# Altium project Coral Dev Board Micro.PrjPcb (part 3 of 5)

## Sheet 07 MIMXRT1170 PART3.SchDoc: Coral 6 Layer Template With Controlled Impedances
size A2; ApprovedBy: DNP; CheckedBy: DNP; Author: DNP; CompanyName: Google LLC; DrawnBy: DNP; Engineer: Stefan; Organization: Google LLC; Address1: 1600 Amphitheatre Parkway; Address2: Mountain View, CA 94043; Address3: DNP; Address4: DNP; DocumentNumber: 7; Revision: PVT; SheetNumber: 7; SheetTotal: 17; VersionControl_RevNumber: DNP; IsUserConfigurable: DNP; Time: DNP; ImagePath: DNP; Rule: DNP; ProjectName: Enterprise; Application_BuildNumber: DNP
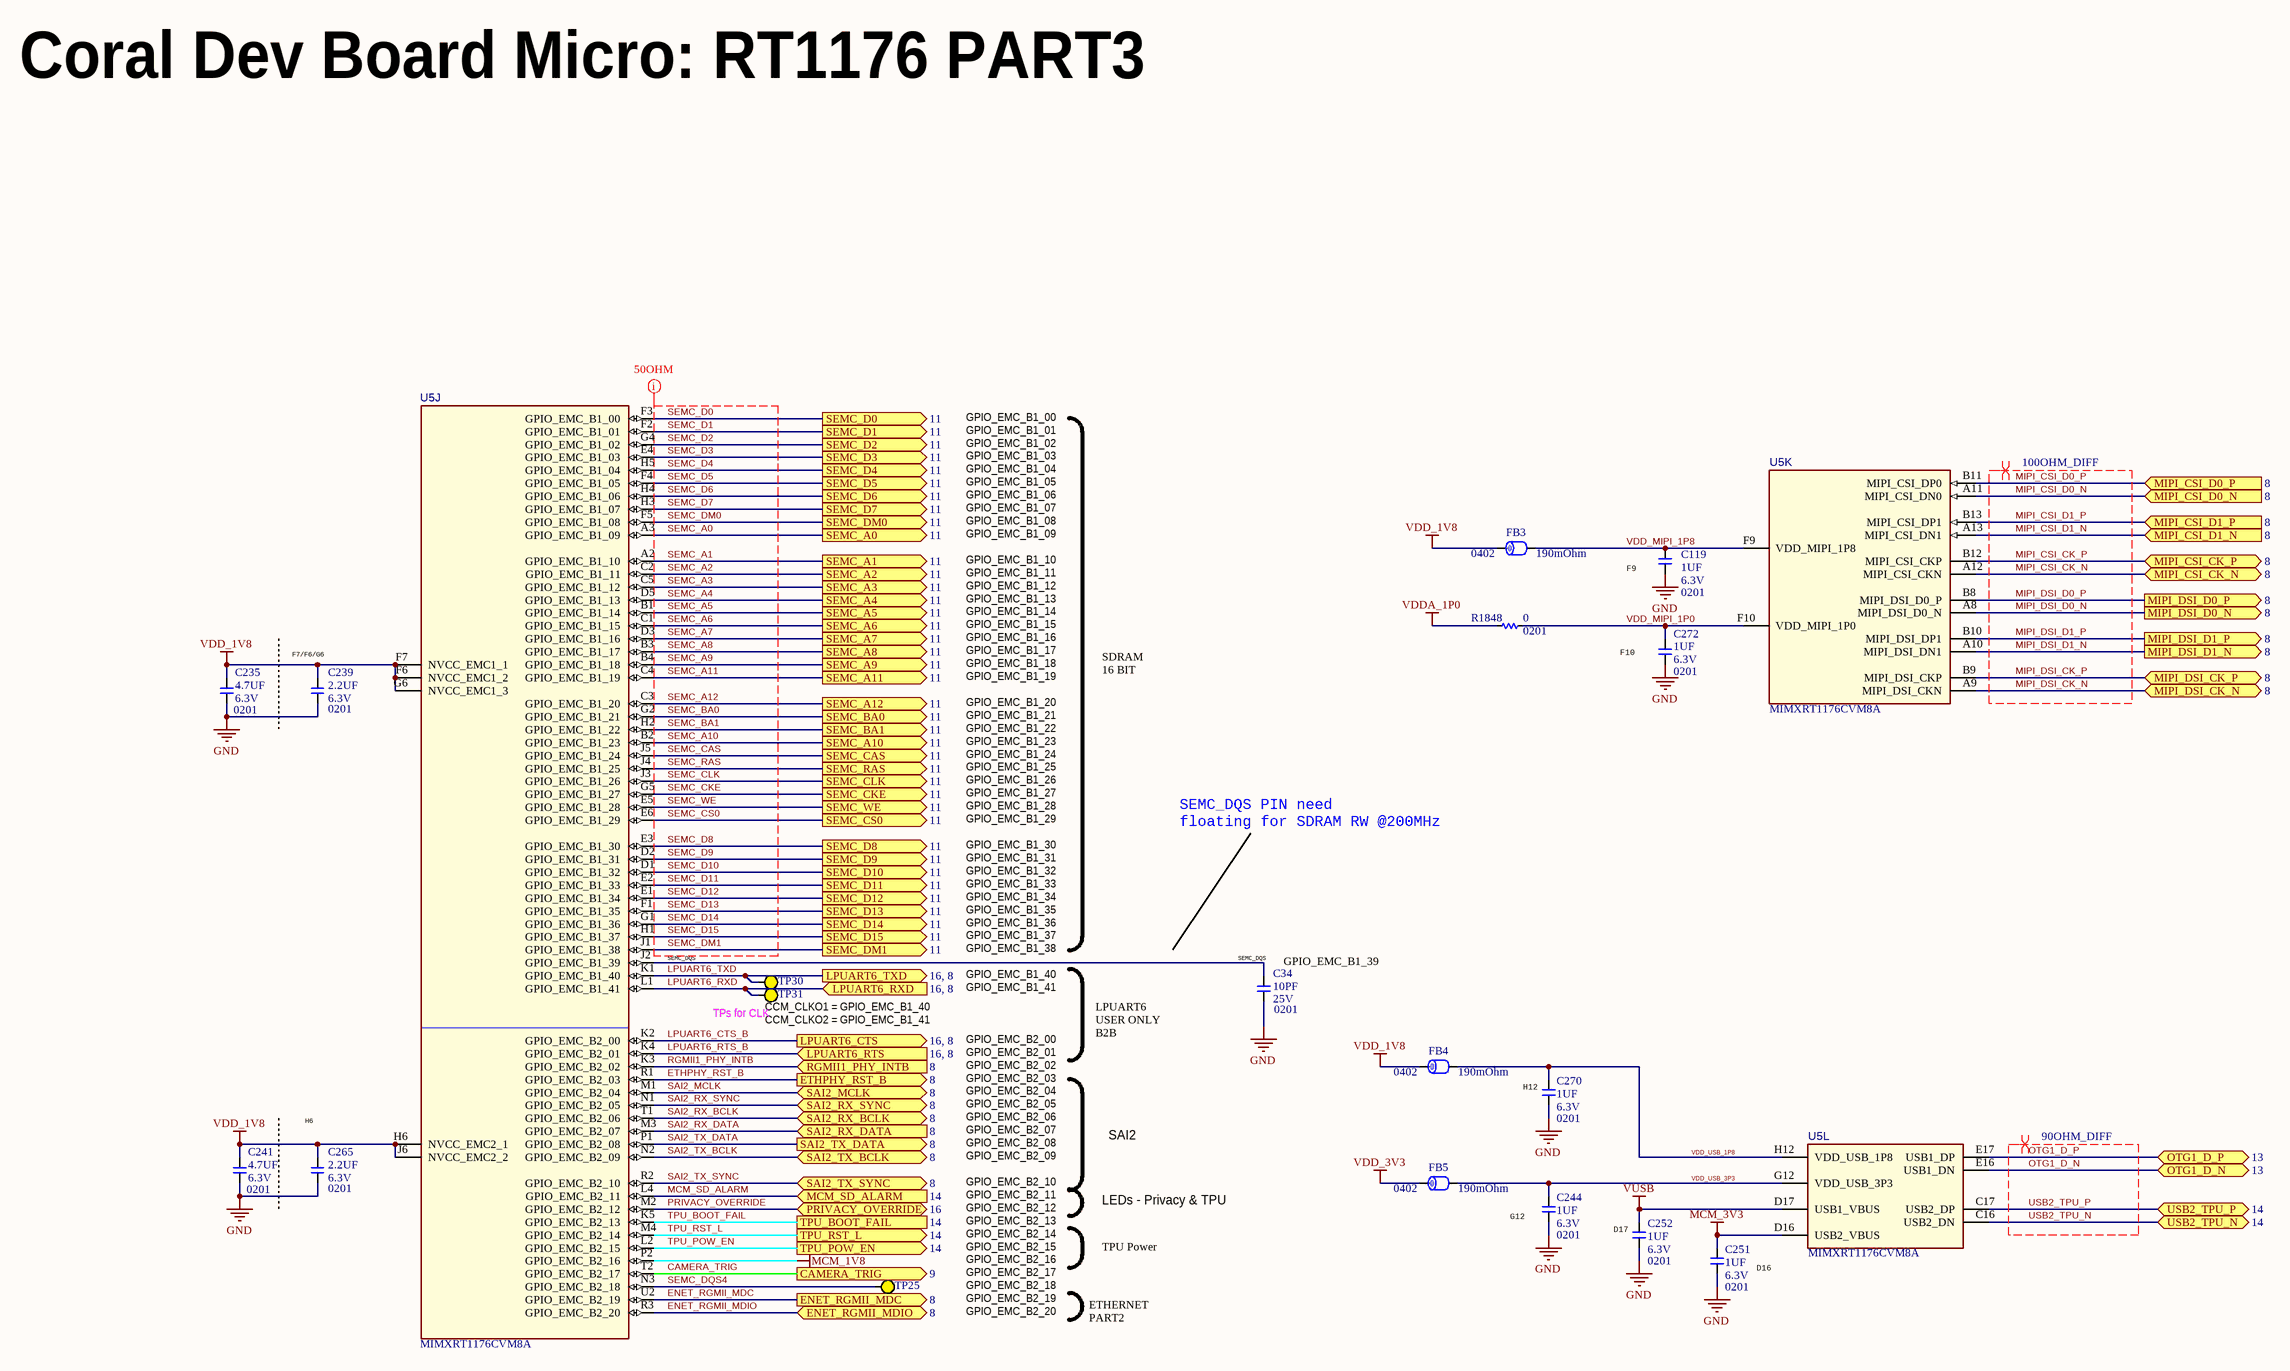
[diagram p10: 07 MIMXRT1170 PART3.SchDoc]

### Parts
C34  value 10PF  Package: 0201  Voltage: 25V  [C0201Y]  (hidden comment: __Template_Cap)
C119  value 1UF  Package: 0201  Voltage: 6.3V  [C0201_H0.39MM]  (hidden comment: __Template_Cap)
C235  value 4.7UF  Package: 0201  Voltage: 6.3V  [C0201Y]  (hidden comment: __Template_Cap)
C239  value 2.2UF  Package: 0201  Voltage: 6.3V  [C0201_H0.39MM]  (hidden comment: __Template_Cap)
C241  value 4.7UF  Package: 0201  Voltage: 6.3V  [C0201Y]  (hidden comment: __Template_Cap)
C244  value 1UF  Package: 0201  Voltage: 6.3V  [C0201_H0.39MM]  (hidden comment: __Template_Cap)
C251  value 1UF  Package: 0201  Voltage: 6.3V  [C0201_H0.39MM]  (hidden comment: __Template_Cap)
C252  value 1UF  Package: 0201  Voltage: 6.3V  [C0201_H0.39MM]  (hidden comment: __Template_Cap)
C265  value 2.2UF  Package: 0201  Voltage: 6.3V  [C0201_H0.39MM]  (hidden comment: __Template_Cap)
C270  value 1UF  Package: 0201  Voltage: 6.3V  [C0201_H0.39MM]  (hidden comment: __Template_Cap)
C272  value 1UF  Package: 0201  Voltage: 6.3V  [C0201_H0.39MM]  (hidden comment: __Template_Cap)
FB3  Package: 0402  Rdc max: 190mOhm  [L0402_H0.55MM]  (hidden comment: __Template_Ferrite_Bead)
FB4  Package: 0402  Rdc max: 190mOhm  [L0402_H0.55MM]  (hidden comment: __Template_Ferrite_Bead)
FB5  Package: 0402  Rdc max: 190mOhm  [L0402_H0.55MM]  (hidden comment: __Template_Ferrite_Bead)
R1848  value 0  Package: 0201  [R0201]
TP25  TESTPAD_30MIL  [TESTPAD_SMT_30MIL]  (value not drawn)  (no BOM)
TP30  TESTPAD_30MIL  [TESTPAD_SMT_30MIL]  (value not drawn)  (no BOM)
TP31  TESTPAD_30MIL  [TESTPAD_SMT_30MIL]  (value not drawn)  (no BOM)
U5  MFG P/N: MIMXRT1176CVM8A  [BGA289C80P17X17_1400X14000X152]  (hidden comment: MCU_MIMXRT1176CVM8A)  (parts J,K,L of 12)

### Ports
CAMERA_TRIG (out, see 9), ENET_RGMII_MDC (out, see 8), ENET_RGMII_MDIO (bidir, see 8), ETHPHY_RST_B (out, see 8), LPUART6_CTS (out, see 16, 8), LPUART6_RTS (in, see 16, 8), LPUART6_RXD (in, see 16, 8), LPUART6_TXD (out, see 16, 8), MCM_SD_ALARM (in, see 14), MIPI_CSI_CK_N (bidir, see 8), MIPI_CSI_CK_P (bidir, see 8), MIPI_CSI_D0_N (in, see 8), MIPI_CSI_D0_P (in, see 8), MIPI_CSI_D1_N (in, see 8), MIPI_CSI_D1_P (in, see 8), MIPI_DSI_CK_N (bidir, see 8), MIPI_DSI_CK_P (bidir, see 8), MIPI_DSI_D0_N (out, see 8), MIPI_DSI_D0_P (out, see 8), MIPI_DSI_D1_N (out, see 8), MIPI_DSI_D1_P (out, see 8), OTG1_D_N (bidir, see 13), OTG1_D_P (bidir, see 13), PRIVACY_OVERRIDE (bidir, see 16), RGMII1_PHY_INTB (in, see 8), SAI2_MCLK (bidir, see 8), SAI2_RX_BCLK (bidir, see 8), SAI2_RX_DATA (in, see 8), SAI2_RX_SYNC (bidir, see 8), SAI2_TX_BCLK (bidir, see 8), SAI2_TX_DATA (out, see 8), SAI2_TX_SYNC (bidir, see 8), SEMC_A0 (out, see 11), SEMC_A1 (out, see 11), SEMC_A2 (out, see 11), SEMC_A3 (out, see 11), SEMC_A4 (out, see 11), SEMC_A5 (out, see 11), SEMC_A6 (out, see 11), SEMC_A7 (out, see 11), SEMC_A8 (out, see 11), SEMC_A9 (out, see 11), SEMC_A10 (out, see 11), SEMC_A11 (out, see 11), SEMC_A12 (out, see 11), SEMC_BA0 (out, see 11), SEMC_BA1 (out, see 11), SEMC_CAS (out, see 11), SEMC_CKE (out, see 11), SEMC_CLK (out, see 11), SEMC_CS0 (out, see 11), SEMC_D0 (out, see 11), SEMC_D1 (out, see 11), SEMC_D2 (out, see 11), SEMC_D3 (out, see 11), SEMC_D4 (out, see 11), SEMC_D5 (out, see 11), SEMC_D6 (out, see 11), SEMC_D7 (out, see 11), SEMC_D8 (out, see 11), SEMC_D9 (out, see 11), SEMC_D10 (out, see 11), SEMC_D11 (out, see 11), SEMC_D12 (out, see 11), SEMC_D13 (out, see 11), SEMC_D14 (out, see 11), SEMC_D15 (out, see 11), SEMC_DM0 (out, see 11), SEMC_DM1 (out, see 11), SEMC_RAS (out, see 11), SEMC_WE (out, see 11), TPU_BOOT_FAIL (see 14), TPU_POW_EN (out, see 14), TPU_RST_L (out, see 14), USB2_TPU_N (bidir, see 14), USB2_TPU_P (bidir, see 14)

### Nets
GND: C34.2 C119.2 C235.2 C239.2 C241.2 C244.2 C251.2 C252.2 C265.2 C270.2 C272.2
MCM_1V8: U5.P2(GPIO_EMC_B2_16)
MCM_3V3: C251.1 U5.D16(USB2_VBUS)
VDD_1V8: C235.1 C239.1 C241.1 C265.1 FB3.1 FB4.1 U5.F6(NVCC_EMC1_2) U5.F7(NVCC_EMC1_1) U5.G6(NVCC_EMC1_3) U5.H6(NVCC_EMC2_1) U5.J6(NVCC_EMC2_2)
VDD_3V3: FB5.1
VDDA_1P0: R1848.1
VUSB: C252.1 U5.D17(USB1_VBUS)
CAMERA_TRIG: U5.T2(GPIO_EMC_B2_17) ; port CAMERA_TRIG
ENET_RGMII_MDC: U5.U2(GPIO_EMC_B2_19) ; port ENET_RGMII_MDC
ENET_RGMII_MDIO: U5.R3(GPIO_EMC_B2_20) ; port ENET_RGMII_MDIO
ETHPHY_RST_B: U5.R1(GPIO_EMC_B2_03) ; port ETHPHY_RST_B
LPUART6_CTS_B: U5.K2(GPIO_EMC_B2_00) ; port LPUART6_CTS
LPUART6_RTS_B: U5.K4(GPIO_EMC_B2_01) ; port LPUART6_RTS
LPUART6_RXD: TP31.1 U5.L1(GPIO_EMC_B1_41) ; port LPUART6_RXD
LPUART6_TXD: TP30.1 U5.K1(GPIO_EMC_B1_40) ; port LPUART6_TXD
MCM_SD_ALARM: U5.L4(GPIO_EMC_B2_11) ; port MCM_SD_ALARM
MIPI_CSI_CK_N: U5.A12(MIPI_CSI_CKN) ; port MIPI_CSI_CK_N
MIPI_CSI_CK_P: U5.B12(MIPI_CSI_CKP) ; port MIPI_CSI_CK_P
MIPI_CSI_D0_N: U5.A11(MIPI_CSI_DN0) ; port MIPI_CSI_D0_N
MIPI_CSI_D0_P: U5.B11(MIPI_CSI_DP0) ; port MIPI_CSI_D0_P
MIPI_CSI_D1_N: U5.A13(MIPI_CSI_DN1) ; port MIPI_CSI_D1_N
MIPI_CSI_D1_P: U5.B13(MIPI_CSI_DP1) ; port MIPI_CSI_D1_P
MIPI_DSI_CK_N: U5.A9(MIPI_DSI_CKN) ; port MIPI_DSI_CK_N
MIPI_DSI_CK_P: U5.B9(MIPI_DSI_CKP) ; port MIPI_DSI_CK_P
MIPI_DSI_D0_N: U5.A8(MIPI_DSI_D0_N) ; port MIPI_DSI_D0_N
MIPI_DSI_D0_P: U5.B8(MIPI_DSI_D0_P) ; port MIPI_DSI_D0_P
MIPI_DSI_D1_N: U5.A10(MIPI_DSI_DN1) ; port MIPI_DSI_D1_N
MIPI_DSI_D1_P: U5.B10(MIPI_DSI_DP1) ; port MIPI_DSI_D1_P
OTG1_D_N: U5.E16(USB1_DN) ; port OTG1_D_N
OTG1_D_P: U5.E17(USB1_DP) ; port OTG1_D_P
PRIVACY_OVERRIDE: U5.M2(GPIO_EMC_B2_12) ; port PRIVACY_OVERRIDE
RGMII1_PHY_INTB: U5.K3(GPIO_EMC_B2_02) ; port RGMII1_PHY_INTB
SAI2_MCLK: U5.M1(GPIO_EMC_B2_04) ; port SAI2_MCLK
SAI2_RX_BCLK: U5.T1(GPIO_EMC_B2_06) ; port SAI2_RX_BCLK
SAI2_RX_DATA: U5.M3(GPIO_EMC_B2_07) ; port SAI2_RX_DATA
SAI2_RX_SYNC: U5.N1(GPIO_EMC_B2_05) ; port SAI2_RX_SYNC
SAI2_TX_BCLK: U5.N2(GPIO_EMC_B2_09) ; port SAI2_TX_BCLK
SAI2_TX_DATA: U5.P1(GPIO_EMC_B2_08) ; port SAI2_TX_DATA
SAI2_TX_SYNC: U5.R2(GPIO_EMC_B2_10) ; port SAI2_TX_SYNC
SEMC_A0: U5.A3(GPIO_EMC_B1_09) ; port SEMC_A0
SEMC_A1: U5.A2(GPIO_EMC_B1_10) ; port SEMC_A1
SEMC_A2: U5.C2(GPIO_EMC_B1_11) ; port SEMC_A2
SEMC_A3: U5.C5(GPIO_EMC_B1_12) ; port SEMC_A3
SEMC_A4: U5.D5(GPIO_EMC_B1_13) ; port SEMC_A4
SEMC_A5: U5.B1(GPIO_EMC_B1_14) ; port SEMC_A5
SEMC_A6: U5.C1(GPIO_EMC_B1_15) ; port SEMC_A6
SEMC_A7: U5.D3(GPIO_EMC_B1_16) ; port SEMC_A7
SEMC_A8: U5.B3(GPIO_EMC_B1_17) ; port SEMC_A8
SEMC_A9: U5.B4(GPIO_EMC_B1_18) ; port SEMC_A9
SEMC_A10: U5.B2(GPIO_EMC_B1_23) ; port SEMC_A10
SEMC_A11: U5.C4(GPIO_EMC_B1_19) ; port SEMC_A11
SEMC_A12: U5.C3(GPIO_EMC_B1_20) ; port SEMC_A12
SEMC_BA0: U5.G2(GPIO_EMC_B1_21) ; port SEMC_BA0
SEMC_BA1: U5.H2(GPIO_EMC_B1_22) ; port SEMC_BA1
SEMC_CAS: U5.J5(GPIO_EMC_B1_24) ; port SEMC_CAS
SEMC_CKE: U5.G5(GPIO_EMC_B1_27) ; port SEMC_CKE
SEMC_CLK: U5.J3(GPIO_EMC_B1_26) ; port SEMC_CLK
SEMC_CS0: U5.E6(GPIO_EMC_B1_29) ; port SEMC_CS0
SEMC_D0: U5.F3(GPIO_EMC_B1_00) ; port SEMC_D0
SEMC_D1: U5.F2(GPIO_EMC_B1_01) ; port SEMC_D1
SEMC_D2: U5.G4(GPIO_EMC_B1_02) ; port SEMC_D2
SEMC_D3: U5.E4(GPIO_EMC_B1_03) ; port SEMC_D3
SEMC_D4: U5.H5(GPIO_EMC_B1_04) ; port SEMC_D4
SEMC_D5: U5.F4(GPIO_EMC_B1_05) ; port SEMC_D5
SEMC_D6: U5.H4(GPIO_EMC_B1_06) ; port SEMC_D6
SEMC_D7: U5.H3(GPIO_EMC_B1_07) ; port SEMC_D7
SEMC_D8: U5.E3(GPIO_EMC_B1_30) ; port SEMC_D8
SEMC_D9: U5.D2(GPIO_EMC_B1_31) ; port SEMC_D9
SEMC_D10: U5.D1(GPIO_EMC_B1_32) ; port SEMC_D10
SEMC_D11: U5.E2(GPIO_EMC_B1_33) ; port SEMC_D11
SEMC_D12: U5.E1(GPIO_EMC_B1_34) ; port SEMC_D12
SEMC_D13: U5.F1(GPIO_EMC_B1_35) ; port SEMC_D13
SEMC_D14: U5.G1(GPIO_EMC_B1_36) ; port SEMC_D14
SEMC_D15: U5.H1(GPIO_EMC_B1_37) ; port SEMC_D15
SEMC_DM0: U5.F5(GPIO_EMC_B1_08) ; port SEMC_DM0
SEMC_DM1: U5.J1(GPIO_EMC_B1_38) ; port SEMC_DM1
SEMC_DQS4: TP25.1 U5.N3(GPIO_EMC_B2_18)
SEMC_RAS: U5.J4(GPIO_EMC_B1_25) ; port SEMC_RAS
SEMC_WE: U5.E5(GPIO_EMC_B1_28) ; port SEMC_WE
TPU_BOOT_FAIL: U5.K5(GPIO_EMC_B2_13) ; port TPU_BOOT_FAIL
TPU_POW_EN: U5.L2(GPIO_EMC_B2_15) ; port TPU_POW_EN
TPU_RST_L: U5.M4(GPIO_EMC_B2_14) ; port TPU_RST_L
USB2_TPU_N: U5.C16(USB2_DN) ; port USB2_TPU_N
USB2_TPU_P: U5.C17(USB2_DP) ; port USB2_TPU_P
VDD_MIPI_1P0: C272.1 R1848.2 U5.F10(VDD_MIPI_1P0)
VDD_MIPI_1P8: C119.1 FB3.2 U5.F9(VDD_MIPI_1P8)
VDD_USB_1P8: C270.1 FB4.2 U5.H12(VDD_USB_1P8)
VDD_USB_3P3: C244.1 FB5.2 U5.G12(VDD_USB_3P3)
NetC34_1: C34.1 U5.J2(GPIO_EMC_B1_39)

### Layout directives
differential pair; differential pair class 100OHM_DIFF: MIPI_CSI_CK_N, MIPI_CSI_CK_P, MIPI_CSI_D0_N, MIPI_CSI_D0_P, MIPI_CSI_D1_N, MIPI_CSI_D1_P, MIPI_DSI_CK_N, MIPI_DSI_CK_P, MIPI_DSI_D0_N, MIPI_DSI_D0_P, MIPI_DSI_D1_N, MIPI_DSI_D1_P
differential pair; differential pair class 90OHM_DIFF: OTG1_D_N, OTG1_D_P, USB2_TPU_N, USB2_TPU_P
net class 50OHM: SEMC_A0, SEMC_A1, SEMC_A2, SEMC_A3, SEMC_A4, SEMC_A5, SEMC_A6, SEMC_A7, SEMC_A8, SEMC_A9, SEMC_A10, SEMC_A11, SEMC_A12, SEMC_BA0, SEMC_BA1, SEMC_CAS, SEMC_CKE, SEMC_CLK, SEMC_CS0, SEMC_D0, SEMC_D1, SEMC_D2, SEMC_D3, SEMC_D4, SEMC_D5, SEMC_D6, SEMC_D7, SEMC_D8, SEMC_D9, SEMC_D10, SEMC_D11, SEMC_D12, SEMC_D13, SEMC_D14, SEMC_D15, SEMC_DM0, SEMC_DM1, SEMC_RAS, SEMC_WE

### Notes on the sheet
- Coral Dev Board Micro: RT1176 PART3
- GPIO_EMC_B1_00
- GPIO_EMC_B1_01
- GPIO_EMC_B1_02
- GPIO_EMC_B1_03
- GPIO_EMC_B1_04
- GPIO_EMC_B1_05
- GPIO_EMC_B1_06
- GPIO_EMC_B1_07
- GPIO_EMC_B1_08
- GPIO_EMC_B1_09
- GPIO_EMC_B1_10
- GPIO_EMC_B1_11
- GPIO_EMC_B1_12
- GPIO_EMC_B1_13
- GPIO_EMC_B1_14
- (near C119) F9
- (near C239) F7/F6/G6
- GPIO_EMC_B1_15
- GPIO_EMC_B1_16
- GPIO_EMC_B1_17
- GPIO_EMC_B1_18
- GPIO_EMC_B1_19
- SDRAM
- 16 BIT
- (near C272) F10
- GPIO_EMC_B1_20
- GPIO_EMC_B1_21
- GPIO_EMC_B1_22
- GPIO_EMC_B1_23
- GPIO_EMC_B1_24
- GPIO_EMC_B1_25
- GPIO_EMC_B1_26
- GPIO_EMC_B1_27
- GPIO_EMC_B1_28
- GPIO_EMC_B1_29
- GPIO_EMC_B1_30
- GPIO_EMC_B1_31
- GPIO_EMC_B1_32
- SEMC_DQS PIN need
  floating for SDRAM RW @200MHz
- GPIO_EMC_B1_33
- GPIO_EMC_B1_34
- GPIO_EMC_B1_35
- GPIO_EMC_B1_36
- GPIO_EMC_B1_37
- GPIO_EMC_B1_38
- (near U5) SEMC_DQS
- (near TP31) CCM_CLKO1 = GPIO_EMC_B1_40
- GPIO_EMC_B1_40
- GPIO_EMC_B1_41
- LPUART6
- (near C34) SEMC_DQS
- (near C34) GPIO_EMC_B1_39
- (near TP31) TPs for CLK
- CCM_CLKO2 = GPIO_EMC_B1_41
- GPIO_EMC_B2_00
- GPIO_EMC_B2_01
- GPIO_EMC_B2_02
- GPIO_EMC_B2_03
- USER ONLY
- B2B
- (near C265) H6
- GPIO_EMC_B2_04
- GPIO_EMC_B2_05
- GPIO_EMC_B2_06
- GPIO_EMC_B2_07
- SAI2
- (near C270) H12
- GPIO_EMC_B2_08
- GPIO_EMC_B2_09
- GPIO_EMC_B2_10
- GPIO_EMC_B2_12
- GPIO_EMC_B2_11
- LEDs - Privacy & TPU
- GPIO_EMC_B2_14
- GPIO_EMC_B2_15
- GPIO_EMC_B2_16
- GPIO_EMC_B2_13
- TPU Power
- (near C244) G12
- (near C252) D17
- D16
- GPIO_EMC_B2_18
- GPIO_EMC_B2_19
- GPIO_EMC_B2_20
- GPIO_EMC_B2_17
- ETHERNET
- PART2
- Project:
- Engineer:
- Date:
- File:
- Revision:
- Sheet
- of

### Library data of the parts
C34 = 614: CAP, CER, NP0, 10pF, 25V, 5%, 0201, 0.33mm T; ID: 614; MFG: MURATA; MFG P/N: OBS: GRM0335C1E100JD01D; XPN: 150-00028-00; EPIC: G150-00028-00; Status: Released; Dielectric: NP0; Tolerance: 5%; Height: 0.33mm T; ComponentLink1Description: Datasheet; COMMON: 150-00028-00; LOON: 150-00028-00; Gecko: 150-00028-00
C119 C244 C251 C252 C270 C272 = 1771: CAP, CER, X6S, 1uF, 20%, 6.3V, 0201, 0.39mm; ID: 1771; MFG: MURATA; MFG P/N: GRM033C80J105ME05D; EPIC: G150-02531-00; Status: In Development; Dielectric: X6S; Tolerance: 20%; Height: 0.39mm; Supplier 1: Digi-Key; HelpURL: https://www.digikey.com/product-detail/en/murata-electronics-north-america/GRM033C80J105ME05D/490-13218-1-ND/5877426; ComponentLink1Description: Datasheet; ComponentLink1URL: https://psearch.en.murata.com/capacitor/product/GRM033C80J105ME05%23.pdf; Supplier Part Number 1: 490-13218-1-ND
C235 C241 = 1199: CAP, CER, X5R, 4.7uF, 20%, 6.3V, 0201; ID: 1199; MFG: MURATA; MFG P/N: GRM035R60J475ME15D; XPN: 150-01224-00; PROXY: 150-03477-00; Status: Released; Dielectric: X5R; Tolerance: 20%; Height: 0.33mm T; ComponentLink1Description: Datasheet; COMMON: 150-01224-00; LOON: 150-01224-00; Gecko: 150-01224-00
C239 C265 = 1761: CAP, CER, X5R, 2.2uF, 20%, 6.3V, 0201, 0.39mm; ID: 1761; MFG: YAGEO; MFG P/N: CC0201MRX5R5BB225; EPIC: G150-01316-00; Status: In Development; Dielectric: X5R; Tolerance: 20%; Height: 0.39mm; Supplier 1: Digi-Key; HelpURL: https://www.digikey.com/product-detail/en/yageo/CC0201MRX5R5BB225/311-3473-1-ND/7164494; ComponentLink1Description: Datasheet; ComponentLink1URL: http://www.yageo.com/documents/recent/UPY-GPHC_X5R_4V-to-50V_25.pdf; Supplier Part Number 1: 311-3473-1-ND
FB3-FB5 = 913: FERRITE, BEAD, 120 OHMS@100MHZ, 25%, 550mA, 190 mOHM DCR, 0402; ID: 913; Catagory: Ferrite Bead; MFG: Murata Electronics; MFG P/N: BLM15AG121SN1D; ComponentLink1Description: Datasheet; Status: Released; Idc max: 550mA; Supplier 1: Digi-Key; HelpURL: https://www.digikey.com/product-detail/en/murata-electronics/BLM15AG121SN1D/490-1005-1-ND/584453; ComponentLink1URL: https://www.murata.com/en-us/products/productdata/8796740059166/ENFA0018.pdf; Height: 0.55mm; Supplier Part Number 1: 490-1005-1-ND
R1848 = 8315: RES, 0.0, 1/20W, 0201; ID: 8315; MFG: PANASONIC; MFG P/N: ERJ1GN0R00C; Tolerance: JUMPER; COMMON: 470-00013-00; PROXY: Use ID #6940; Status: Released; Power: 1/20W; LOON: 470-00013-00; Gecko: 470-00013-00; XPN: 470-00013-00
TP25 TP30 TP31 = 178: TESTPAD_SMT_30MIL; ID: 178; MFG: _PCB Feature; Status: Released; ComponentLink1URL: _PCB Feature
U5 = 117: IC, PROCESSOR, MIMXRT1176CV, ARM CORTEX-M4/M7, 2MB RAM, SDRAM, WLAN, BGA-289; ID: 117; MFG: NXP Semiconductors; Status: Released; Package: BGA-289; Category: Integrated Circuits (ICs); RoHS Compliant: Yes; ComponentLink1Description: Datasheet; ComponentLink1URL: https://drive.google.com/file/d/1FTzS3WjHycHWpbzAg-R_xAViv5bKJdqv/view; Height: 1.52mm

## Sheet 08 B2B.SchDoc: Coral 6 Layer Template With Controlled Impedances
size A2; ApprovedBy: DNP; CheckedBy: DNP; Author: DNP; CompanyName: Google LLC; DrawnBy: DNP; Engineer: Stefan; Organization: Google LLC; Address1: 1600 Amphitheatre Parkway; Address2: Mountain View, CA 94043; Address3: DNP; Address4: DNP; DocumentNumber: 8; Revision: PVT; SheetNumber: 8; SheetTotal: 17; VersionControl_RevNumber: DNP; IsUserConfigurable: DNP; Time: DNP; ImagePath: DNP; Rule: DNP; ProjectName: Enterprise; Application_BuildNumber: DNP
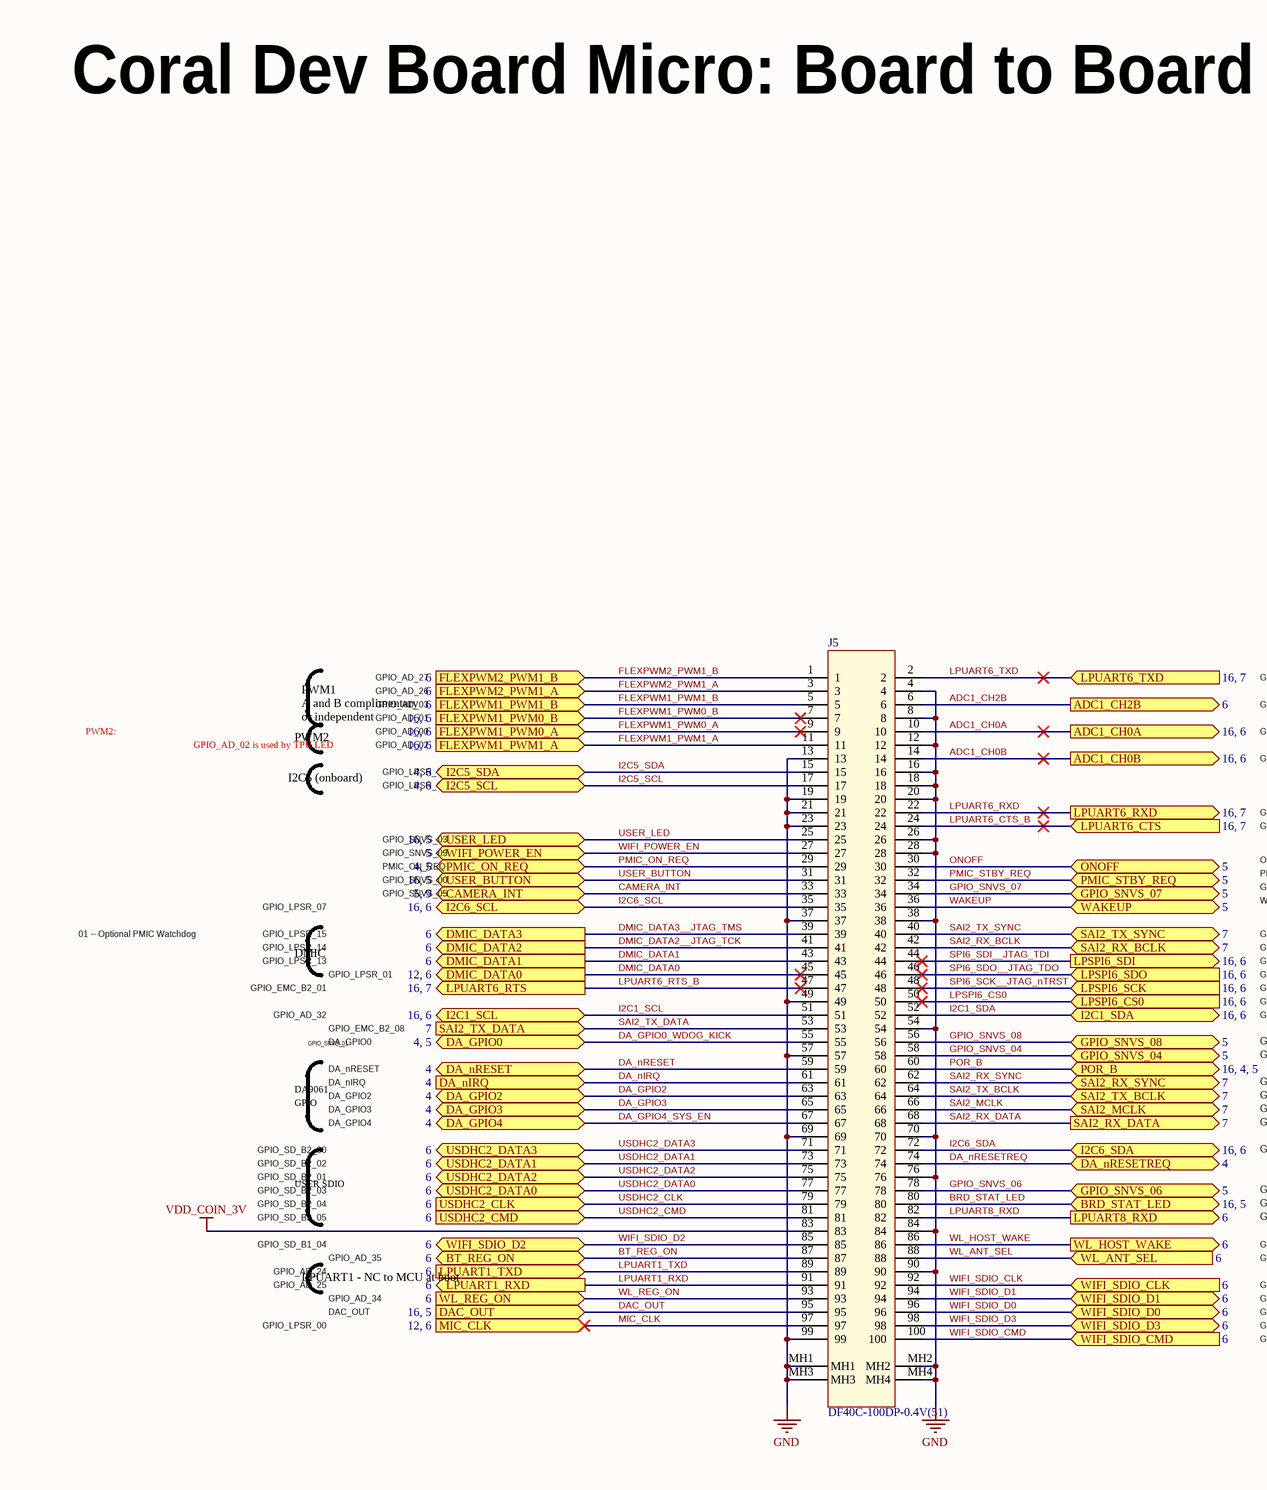
[diagram p11: 08 B2B.SchDoc, left]
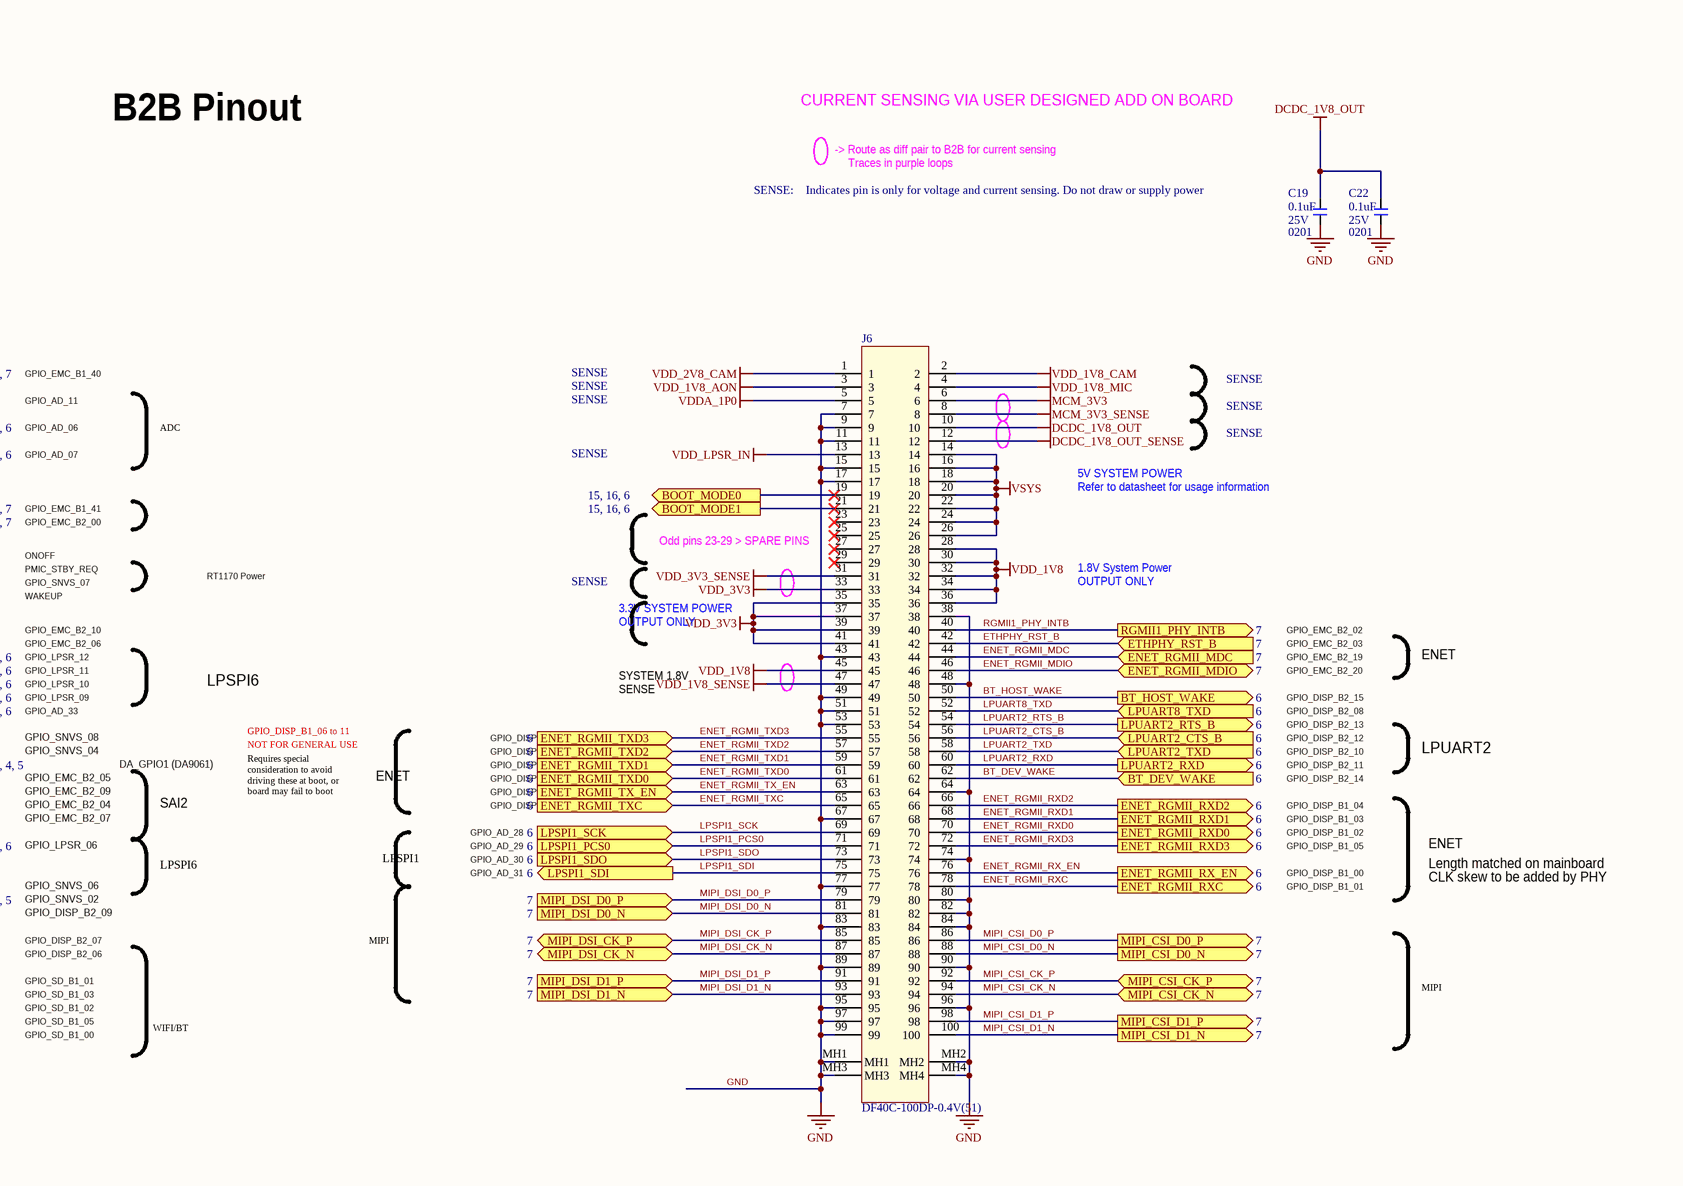
[diagram p12: 08 B2B.SchDoc, right]

### Parts
C19  value 0.1uF  Package: 0201  Voltage: 25V  [C0201Y]  (hidden comment: __Template_Cap)
C22  value 0.1uF  Package: 0201  Voltage: 25V  [C0201Y]  (hidden comment: __Template_Cap)
J5  MFG P/N: DF40C-100DP-0.4V(51)  [HIROSE_DF40C-100DP-0.4V(51)]
J6  MFG P/N: DF40C-100DP-0.4V(51)  [HIROSE_DF40C-100DP-0.4V(51)]

### Ports
ADC1_CH0A (out, see 16, 6), ADC1_CH0B (out, see 16, 6), ADC1_CH2B (out, see 6), BOOT_MODE0 (out, see 15, 16, 6), BOOT_MODE1 (out, see 15, 16, 6), BRD_STAT_LED (bidir, see 16, 5), BT_DEV_WAKE (in, see 6), BT_HOST_WAKE (out, see 6), BT_REG_ON (bidir, see 6), CAMERA_INT (bidir, see 5, 9), DA_GPIO0 (bidir, see 4, 5), DA_GPIO2 (bidir, see 4), DA_GPIO3 (bidir, see 4), DA_GPIO4 (bidir, see 4), DA_nIRQ (in, see 4), DA_nRESET (bidir, see 4), DA_nRESETREQ (bidir, see 4), DAC_OUT (in, see 16, 5), DMIC_DATA0 (out, see 12, 6), DMIC_DATA1 (out, see 6), DMIC_DATA2 (out, see 6), DMIC_DATA3 (out, see 6), ENET_RGMII_MDC (in, see 7), ENET_RGMII_MDIO (bidir, see 7), ENET_RGMII_RX_EN (out, see 6), ENET_RGMII_RXC (out, see 6), ENET_RGMII_RXD0 (out, see 6), ENET_RGMII_RXD1 (out, see 6), ENET_RGMII_RXD2 (out, see 6), ENET_RGMII_RXD3 (out, see 6), ENET_RGMII_TX_EN (in, see 6), ENET_RGMII_TXC (in, see 6), ENET_RGMII_TXD0 (in, see 6), ENET_RGMII_TXD1 (in, see 6), ENET_RGMII_TXD2 (in, see 6), ENET_RGMII_TXD3 (in, see 6), ETHPHY_RST_B (in, see 7), FLEXPWM1_PWM0_A (in, see 16, 6), FLEXPWM1_PWM0_B (in, see 16, 6), FLEXPWM1_PWM1_A (in, see 16, 6), FLEXPWM1_PWM1_B (in, see 6), FLEXPWM2_PWM1_A (in, see 6), FLEXPWM2_PWM1_B (in, see 6), GPIO_SNVS_04 (bidir, see 5), GPIO_SNVS_06 (bidir, see 5), GPIO_SNVS_07 (bidir, see 5), GPIO_SNVS_08 (bidir, see 5), I2C1_SCL (bidir, see 16, 6), I2C1_SDA (bidir, see 16, 6), I2C5_SCL (bidir, see 4, 6), I2C5_SDA (bidir, see 4, 6), I2C6_SCL (bidir, see 16, 6), I2C6_SDA (bidir, see 16, 6), LPSPI1_PCS0 (in, see 6), LPSPI1_SCK (in, see 6), LPSPI1_SDI (out, see 6), LPSPI1_SDO (in, see 6), LPSPI6_CS0 (in, see 16, 6), LPSPI6_SCK (in, see 16, 6), LPSPI6_SDI (out, see 16, 6), LPSPI6_SDO (in, see 16, 6), LPUART1_RXD (out, see 6), LPUART1_TXD (in, see 6), LPUART2_CTS_B (in, see 6), LPUART2_RTS_B (out, see 6), LPUART2_RXD (out, see 6), LPUART2_TXD (in, see 6), LPUART6_CTS (in, see 16, 7), LPUART6_RTS (out, see 16, 7), LPUART6_RXD (out, see 16, 7), LPUART6_TXD (in, see 16, 7), LPUART8_RXD (out, see 6), LPUART8_TXD (in, see 6), MIC_CLK (in, see 12, 6), MIPI_CSI_CK_N (bidir, see 7), MIPI_CSI_CK_P (bidir, see 7), MIPI_CSI_D0_N (out, see 7), MIPI_CSI_D0_P (out, see 7), MIPI_CSI_D1_N (out, see 7), MIPI_CSI_D1_P (out, see 7), MIPI_DSI_CK_N (bidir, see 7), MIPI_DSI_CK_P (bidir, see 7), MIPI_DSI_D0_N (in, see 7), MIPI_DSI_D0_P (in, see 7), MIPI_DSI_D1_N (in, see 7), MIPI_DSI_D1_P (in, see 7), ONOFF (bidir, see 5), PMIC_ON_REQ (bidir, see 4, 5), PMIC_STBY_REQ (bidir, see 5), POR_B (bidir, see 16, 4, 5), RGMII1_PHY_INTB (out, see 7), SAI2_MCLK (bidir, see 7), SAI2_RX_BCLK (bidir, see 7), SAI2_RX_DATA (out, see 7), SAI2_RX_SYNC (bidir, see 7), SAI2_TX_BCLK (bidir, see 7), SAI2_TX_DATA (in, see 7), SAI2_TX_SYNC (bidir, see 7), USDHC2_CLK (in, see 6), USDHC2_CMD (in, see 6), USDHC2_DATA0 (bidir, see 6), USDHC2_DATA1 (bidir, see 6), USDHC2_DATA2 (bidir, see 6), USDHC2_DATA3 (bidir, see 6), USER_BUTTON (bidir, see 16, 5), USER_LED (bidir, see 16, 5), WAKEUP (bidir, see 5), WIFI_POWER_EN (bidir, see 5), WIFI_SDIO_CLK (in, see 6), WIFI_SDIO_CMD (in, see 6), WIFI_SDIO_D0 (bidir, see 6), WIFI_SDIO_D1 (bidir, see 6), WIFI_SDIO_D2 (bidir, see 6), WIFI_SDIO_D3 (bidir, see 6), WL_ANT_SEL (in, see 6), WL_HOST_WAKE (out, see 6), WL_REG_ON (in, see 6)

### Nets
DCDC_1V8_OUT: C19.1 C22.1 J6.10
DCDC_1V8_OUT_SENSE: J6.12
GND: C19.2 C22.2 J5.4 J5.8 J5.12 J5.13 J5.16 J5.18 J5.19 J5.20 J5.21 J5.23 J5.26 J5.28 J5.37 J5.38 J5.49 J5.54 J5.57 J5.69 J5.70 J5.76 J5.84 J5.90 J5.99 J5.MH1 J5.MH2 J5.MH3 J5.MH4 J6.7 J6.9 J6.11 J6.15 J6.17 J6.38 J6.43 J6.48 J6.49 J6.51 J6.53 J6.64 J6.67 J6.74 J6.77 J6.80 J6.82 J6.83 J6.84 J6.89 J6.90 J6.95 J6.96 J6.97 J6.99 J6.MH1 J6.MH2 J6.MH3 J6.MH4
MCM_3V3: J6.6
MCM_3V3_SENSE: J6.8
VDD_1V8: J6.28 J6.30 J6.32 J6.34 J6.36 J6.45
VDD_1V8_AON: J6.3
VDD_1V8_CAM: J6.2
VDD_1V8_MIC: J6.4
VDD_1V8_SENSE: J6.47
VDD_2V8_CAM: J6.1
VDD_3V3: J6.33 J6.35 J6.37 J6.39 J6.41
VDD_3V3_SENSE: J6.31
VDD_COIN_3V: J5.83
VDD_LPSR_IN: J6.13
VDDA_1P0: J6.5
VSYS: J6.14 J6.16 J6.18 J6.20 J6.22 J6.24 J6.26
ADC1_CH0A: J5.10 ; port ADC1_CH0A
ADC1_CH0B: J5.14 ; port ADC1_CH0B
ADC1_CH2B: J5.6 ; port ADC1_CH2B
BOOT_MODE0: J6.19 ; port BOOT_MODE0
BOOT_MODE1: J6.21 ; port BOOT_MODE1
BRD_STAT_LED: J5.80 ; port BRD_STAT_LED
BT_DEV_WAKE: J6.62 ; port BT_DEV_WAKE
BT_HOST_WAKE: J6.50 ; port BT_HOST_WAKE
BT_REG_ON: J5.87 ; port BT_REG_ON
CAMERA_INT: J5.33 ; port CAMERA_INT
DA_GPIO0_WDOG_KICK: J5.55 ; port DA_GPIO0
DA_GPIO2: J5.63 ; port DA_GPIO2
DA_GPIO3: J5.65 ; port DA_GPIO3
DA_GPIO4_SYS_EN: J5.67 ; port DA_GPIO4
DA_nIRQ: J5.61 ; port DA_nIRQ
DA_nRESET: J5.59 ; port DA_nRESET
DA_nRESETREQ: J5.74 ; port DA_nRESETREQ
DAC_OUT: J5.95 ; port DAC_OUT
DMIC_DATA0: J5.45 ; port DMIC_DATA0
DMIC_DATA1: J5.43 ; port DMIC_DATA1
DMIC_DATA2__JTAG_TCK: J5.41 ; port DMIC_DATA2
DMIC_DATA3__JTAG_TMS: J5.39 ; port DMIC_DATA3
ENET_RGMII_MDC: J6.44 ; port ENET_RGMII_MDC
ENET_RGMII_MDIO: J6.46 ; port ENET_RGMII_MDIO
ENET_RGMII_RX_EN: J6.76 ; port ENET_RGMII_RX_EN
ENET_RGMII_RXC: J6.78 ; port ENET_RGMII_RXC
ENET_RGMII_RXD0: J6.70 ; port ENET_RGMII_RXD0
ENET_RGMII_RXD1: J6.68 ; port ENET_RGMII_RXD1
ENET_RGMII_RXD2: J6.66 ; port ENET_RGMII_RXD2
ENET_RGMII_RXD3: J6.72 ; port ENET_RGMII_RXD3
ENET_RGMII_TX_EN: J6.63 ; port ENET_RGMII_TX_EN
ENET_RGMII_TXC: J6.65 ; port ENET_RGMII_TXC
ENET_RGMII_TXD0: J6.61 ; port ENET_RGMII_TXD0
ENET_RGMII_TXD1: J6.59 ; port ENET_RGMII_TXD1
ENET_RGMII_TXD2: J6.57 ; port ENET_RGMII_TXD2
ENET_RGMII_TXD3: J6.55 ; port ENET_RGMII_TXD3
ETHPHY_RST_B: J6.42 ; port ETHPHY_RST_B
FLEXPWM1_PWM0_A: J5.9 ; port FLEXPWM1_PWM0_A
FLEXPWM1_PWM0_B: J5.7 ; port FLEXPWM1_PWM0_B
FLEXPWM1_PWM1_A: J5.11 ; port FLEXPWM1_PWM1_A
FLEXPWM1_PWM1_B: J5.5 ; port FLEXPWM1_PWM1_B
FLEXPWM2_PWM1_A: J5.3 ; port FLEXPWM2_PWM1_A
FLEXPWM2_PWM1_B: J5.1 ; port FLEXPWM2_PWM1_B
GPIO_SNVS_04: J5.58 ; port GPIO_SNVS_04
GPIO_SNVS_06: J5.78 ; port GPIO_SNVS_06
GPIO_SNVS_07: J5.34 ; port GPIO_SNVS_07
GPIO_SNVS_08: J5.56 ; port GPIO_SNVS_08
I2C1_SCL: J5.51 ; port I2C1_SCL
I2C1_SDA: J5.52 ; port I2C1_SDA
I2C5_SCL: J5.17 ; port I2C5_SCL
I2C5_SDA: J5.15 ; port I2C5_SDA
I2C6_SCL: J5.35 ; port I2C6_SCL
I2C6_SDA: J5.72 ; port I2C6_SDA
LPSPI1_PCS0: J6.71 ; port LPSPI1_PCS0
LPSPI1_SCK: J6.69 ; port LPSPI1_SCK
LPSPI1_SDI: J6.75 ; port LPSPI1_SDI
LPSPI1_SDO: J6.73 ; port LPSPI1_SDO
LPSPI6_CS0: J5.50 ; port LPSPI6_CS0
LPUART1_RXD: J5.91 ; port LPUART1_RXD
LPUART1_TXD: J5.89 ; port LPUART1_TXD
LPUART2_CTS_B: J6.56 ; port LPUART2_CTS_B
LPUART2_RTS_B: J6.54 ; port LPUART2_RTS_B
LPUART2_RXD: J6.60 ; port LPUART2_RXD
LPUART2_TXD: J6.58 ; port LPUART2_TXD
LPUART6_CTS_B: J5.24 ; port LPUART6_CTS
LPUART6_RTS_B: J5.47 ; port LPUART6_RTS
LPUART6_RXD: J5.22 ; port LPUART6_RXD
LPUART6_TXD: J5.2 ; port LPUART6_TXD
LPUART8_RXD: J5.82 ; port LPUART8_RXD
LPUART8_TXD: J6.52 ; port LPUART8_TXD
MIC_CLK: J5.97 ; port MIC_CLK
MIPI_CSI_CK_N: J6.94 ; port MIPI_CSI_CK_N
MIPI_CSI_CK_P: J6.92 ; port MIPI_CSI_CK_P
MIPI_CSI_D0_N: J6.88 ; port MIPI_CSI_D0_N
MIPI_CSI_D0_P: J6.86 ; port MIPI_CSI_D0_P
MIPI_CSI_D1_N: J6.100 ; port MIPI_CSI_D1_N
MIPI_CSI_D1_P: J6.98 ; port MIPI_CSI_D1_P
MIPI_DSI_CK_N: J6.87 ; port MIPI_DSI_CK_N
MIPI_DSI_CK_P: J6.85 ; port MIPI_DSI_CK_P
MIPI_DSI_D0_N: J6.81 ; port MIPI_DSI_D0_N
MIPI_DSI_D0_P: J6.79 ; port MIPI_DSI_D0_P
MIPI_DSI_D1_N: J6.93 ; port MIPI_DSI_D1_N
MIPI_DSI_D1_P: J6.91 ; port MIPI_DSI_D1_P
ONOFF: J5.30 ; port ONOFF
PMIC_ON_REQ: J5.29 ; port PMIC_ON_REQ
PMIC_STBY_REQ: J5.32 ; port PMIC_STBY_REQ
POR_B: J5.60 ; port POR_B
RGMII1_PHY_INTB: J6.40 ; port RGMII1_PHY_INTB
SAI2_MCLK: J5.66 ; port SAI2_MCLK
SAI2_RX_BCLK: J5.42 ; port SAI2_RX_BCLK
SAI2_RX_DATA: J5.68 ; port SAI2_RX_DATA
SAI2_RX_SYNC: J5.62 ; port SAI2_RX_SYNC
SAI2_TX_BCLK: J5.64 ; port SAI2_TX_BCLK
SAI2_TX_DATA: J5.53 ; port SAI2_TX_DATA
SAI2_TX_SYNC: J5.40 ; port SAI2_TX_SYNC
SPI6_SCK__JTAG_nTRST: J5.48 ; port LPSPI6_SCK
SPI6_SDI__JTAG_TDI: J5.44 ; port LPSPI6_SDI
SPI6_SDO__JTAG_TDO: J5.46 ; port LPSPI6_SDO
USDHC2_CLK: J5.79 ; port USDHC2_CLK
USDHC2_CMD: J5.81 ; port USDHC2_CMD
USDHC2_DATA0: J5.77 ; port USDHC2_DATA0
USDHC2_DATA1: J5.73 ; port USDHC2_DATA1
USDHC2_DATA2: J5.75 ; port USDHC2_DATA2
USDHC2_DATA3: J5.71 ; port USDHC2_DATA3
USER_BUTTON: J5.31 ; port USER_BUTTON
USER_LED: J5.25 ; port USER_LED
WAKEUP: J5.36 ; port WAKEUP
WIFI_POWER_EN: J5.27 ; port WIFI_POWER_EN
WIFI_SDIO_CLK: J5.92 ; port WIFI_SDIO_CLK
WIFI_SDIO_CMD: J5.100 ; port WIFI_SDIO_CMD
WIFI_SDIO_D0: J5.96 ; port WIFI_SDIO_D0
WIFI_SDIO_D1: J5.94 ; port WIFI_SDIO_D1
WIFI_SDIO_D2: J5.85 ; port WIFI_SDIO_D2
WIFI_SDIO_D3: J5.98 ; port WIFI_SDIO_D3
WL_ANT_SEL: J5.88 ; port WL_ANT_SEL
WL_HOST_WAKE: J5.86 ; port WL_HOST_WAKE
WL_REG_ON: J5.93 ; port WL_REG_ON

Not connected (* = marked no-connect by the designer): J6 23* 25* 27* 29*

### Notes on the sheet
- Coral Dev Board Micro: Board to Board Connector
- B2B Pinout
- CURRENT SENSING VIA USER DESIGNED ADD ON BOARD
- -> Route as diff pair to B2B for current sensing
- (near C19) SENSE:    Indicates pin is only for voltage and current sensing. Do not draw or supply power
- Traces in purple loops
- PWM2:
- PWM1
- A and B complimentary
- or independent
- GPIO_AD_00
- GPIO_AD_01
- GPIO_AD_03
- GPIO_AD_26
- GPIO_AD_27
- GPIO_EMC_B1_40
- GPIO_AD_11
- GPIO_AD_06
- ADC
- SENSE
- GPIO_AD_02 is used by TPU LED
- I2C5 (onboard)
- PWM2
- GPIO_AD_02
- GPIO_LPSR_04
- GPIO_LPSR_05
- GPIO_AD_07
- 5V SYSTEM POWER
- Refer to datasheet for usage information
- GPIO_SNVS_03
- GPIO_SNVS_09
- PMIC_ON_REQ
- GPIO_EMC_B2_00
- GPIO_EMC_B1_41
- ONOFF
- (near J6) Odd pins 23-29 > SPARE PINS
- GPIO_LPSR_07
- GPIO_SNVS_00
- GPIO_SNVS_05
- GPIO_SNVS_07
- WAKEUP
- PMIC_STBY_REQ
- RT1170 Power
- 3.3V SYSTEM POWER
- OUTPUT ONLY
- 1.8V System Power
- 01 -- Optional PMIC Watchdog
- DMIC
- GPIO_EMC_B2_01
- GPIO_LPSR_13
- GPIO_LPSR_14
- GPIO_LPSR_15
- GPIO_LPSR_01
- GPIO_EMC_B2_06
- GPIO_EMC_B2_10
- GPIO_LPSR_09
- GPIO_LPSR_10
- GPIO_LPSR_11
- GPIO_LPSR_12
- LPSPI6
- SYSTEM 1.8V
- GPIO_EMC_B2_02
- GPIO_EMC_B2_19
- GPIO_EMC_B2_20
- GPIO_EMC_B2_03
- GPIO_DISP_B2_15
- ENET
- GPIO_SNVS_01
- GPIO_AD_32
- DA_GPIO0
- GPIO_EMC_B2_08
- GPIO_SNVS_04
- GPIO_AD_33
- GPIO_SNVS_08
- NOT FOR GENERAL USE
- GPIO_DISP_B1_06 to 11
- GPIO_DISP_B1_06
- GPIO_DISP_B1_07
- GPIO_DISP_B2_10
- GPIO_DISP_B2_13
- GPIO_DISP_B2_08
- GPIO_DISP_B2_12
- LPUART2
- DA9061
- GPIO
- DA_GPIO2
- DA_GPIO3
- DA_GPIO4
- DA_nRESET
- DA_nIRQ
- GPIO_EMC_B2_04
- GPIO_EMC_B2_05
- GPIO_EMC_B2_07
- GPIO_EMC_B2_09
- DA_GPIO1 (DA9061)
- SAI2
- Requires special consideration to avoid driving these at boot, or board may fail to boot
- GPIO_AD_28
- GPIO_DISP_B1_08
- GPIO_DISP_B1_09
- GPIO_DISP_B1_10
- GPIO_DISP_B1_11
- GPIO_DISP_B2_11
- GPIO_DISP_B1_02
- GPIO_DISP_B1_03
- GPIO_DISP_B1_04
- GPIO_DISP_B2_14
- USER SDIO
- GPIO_SD_B2_00
- GPIO_SD_B2_01
- GPIO_SD_B2_02
- GPIO_SD_B2_03
- GPIO_SNVS_06
- GPIO_LPSR_06
- LPSPI1
- GPIO_AD_29
- GPIO_AD_30
- GPIO_AD_31
- GPIO_DISP_B1_00
- GPIO_DISP_B1_01
- GPIO_DISP_B1_05
- Length matched on mainboard
- CLK skew to be added by PHY
- GPIO_SD_B1_04
- GPIO_AD_24
- GPIO_SD_B2_04
- GPIO_SD_B2_05
- GPIO_AD_35
- GPIO_SNVS_02
- GPIO_DISP_B2_09
- GPIO_DISP_B2_07
- GPIO_DISP_B2_06
- MIPI
- LPUART1 - NC to MCU at boot
- GPIO_AD_25
- GPIO_LPSR_00
- DAC_OUT
- GPIO_AD_34
- GPIO_SD_B1_01
- GPIO_SD_B1_02
- GPIO_SD_B1_03
- GPIO_SD_B1_05
- WIFI/BT
- GPIO_SD_B1_00
- Project:
- Engineer:
- Date:
- File:
- Revision:
- Sheet
- of

### Library data of the parts
C19 C22 = 386: CAP, CER, X5R, 0.1uF, 25V, 20%, 0201, 0.33mm T; ID: 386; MFG: MURATA; MFG P/N: GRM033R61E104ME14D; XPN: 150-01204-00; Status: Released; Dielectric: X5R; Tolerance: 20%; Height: 0.33mm T; ComponentLink1Description: Datasheet; COMMON: 150-01204-00; LOON: 150-01204-00; Gecko: 150-01204-00
J5 J6 = 897: CONN, HDR, VERT, 2x50, 0.4MM P, 1.14MM H, GOLD, SMD; ID: 897; MFG: Hirose Electric Co Ltd; Connector Type: Plug, Outer Shroud Contacts; Pitch: 0.40mm; Number of Positions: 100; Gender: Male; Status: Released; RoHS Compliant: Yes; Mounting Type: Surface Mount; Orientation: Vertical; Number of Rows: 2; Features: Solder Retention; Supplier 1: Digi-Key; HelpURL: https://www.digikey.com/product-detail/en/hirose-electric-co-ltd/DF40C-100DP-0.4V-51/H11614CT-ND/1969494; ComponentLink1Description: Datasheet; ComponentLink1URL: https://www.hirose.com/product/download/?distributor=digikey&type=2d&lang=en&num=DF40C-100DP-0.4V(51); Supplier Part Number 1: H11614CT-ND

## Sheet 09 Parallel Camera.SchDoc: Coral 6 Layer Template With Controlled Impedances
size A2; ApprovedBy: DNP; CheckedBy: DNP; Author: DNP; CompanyName: Google LLC; DrawnBy: DNP; Engineer: Stefan; Organization: Google LLC; Address1: 1600 Amphitheatre Parkway; Address2: Mountain View, CA 94043; Address3: DNP; Address4: DNP; DocumentNumber: 9; Revision: PVT; SheetNumber: 9; SheetTotal: 17; VersionControl_RevNumber: DNP; IsUserConfigurable: DNP; Time: DNP; ImagePath: DNP; Rule: DNP; ProjectName: Enterprise; Application_BuildNumber: DNP
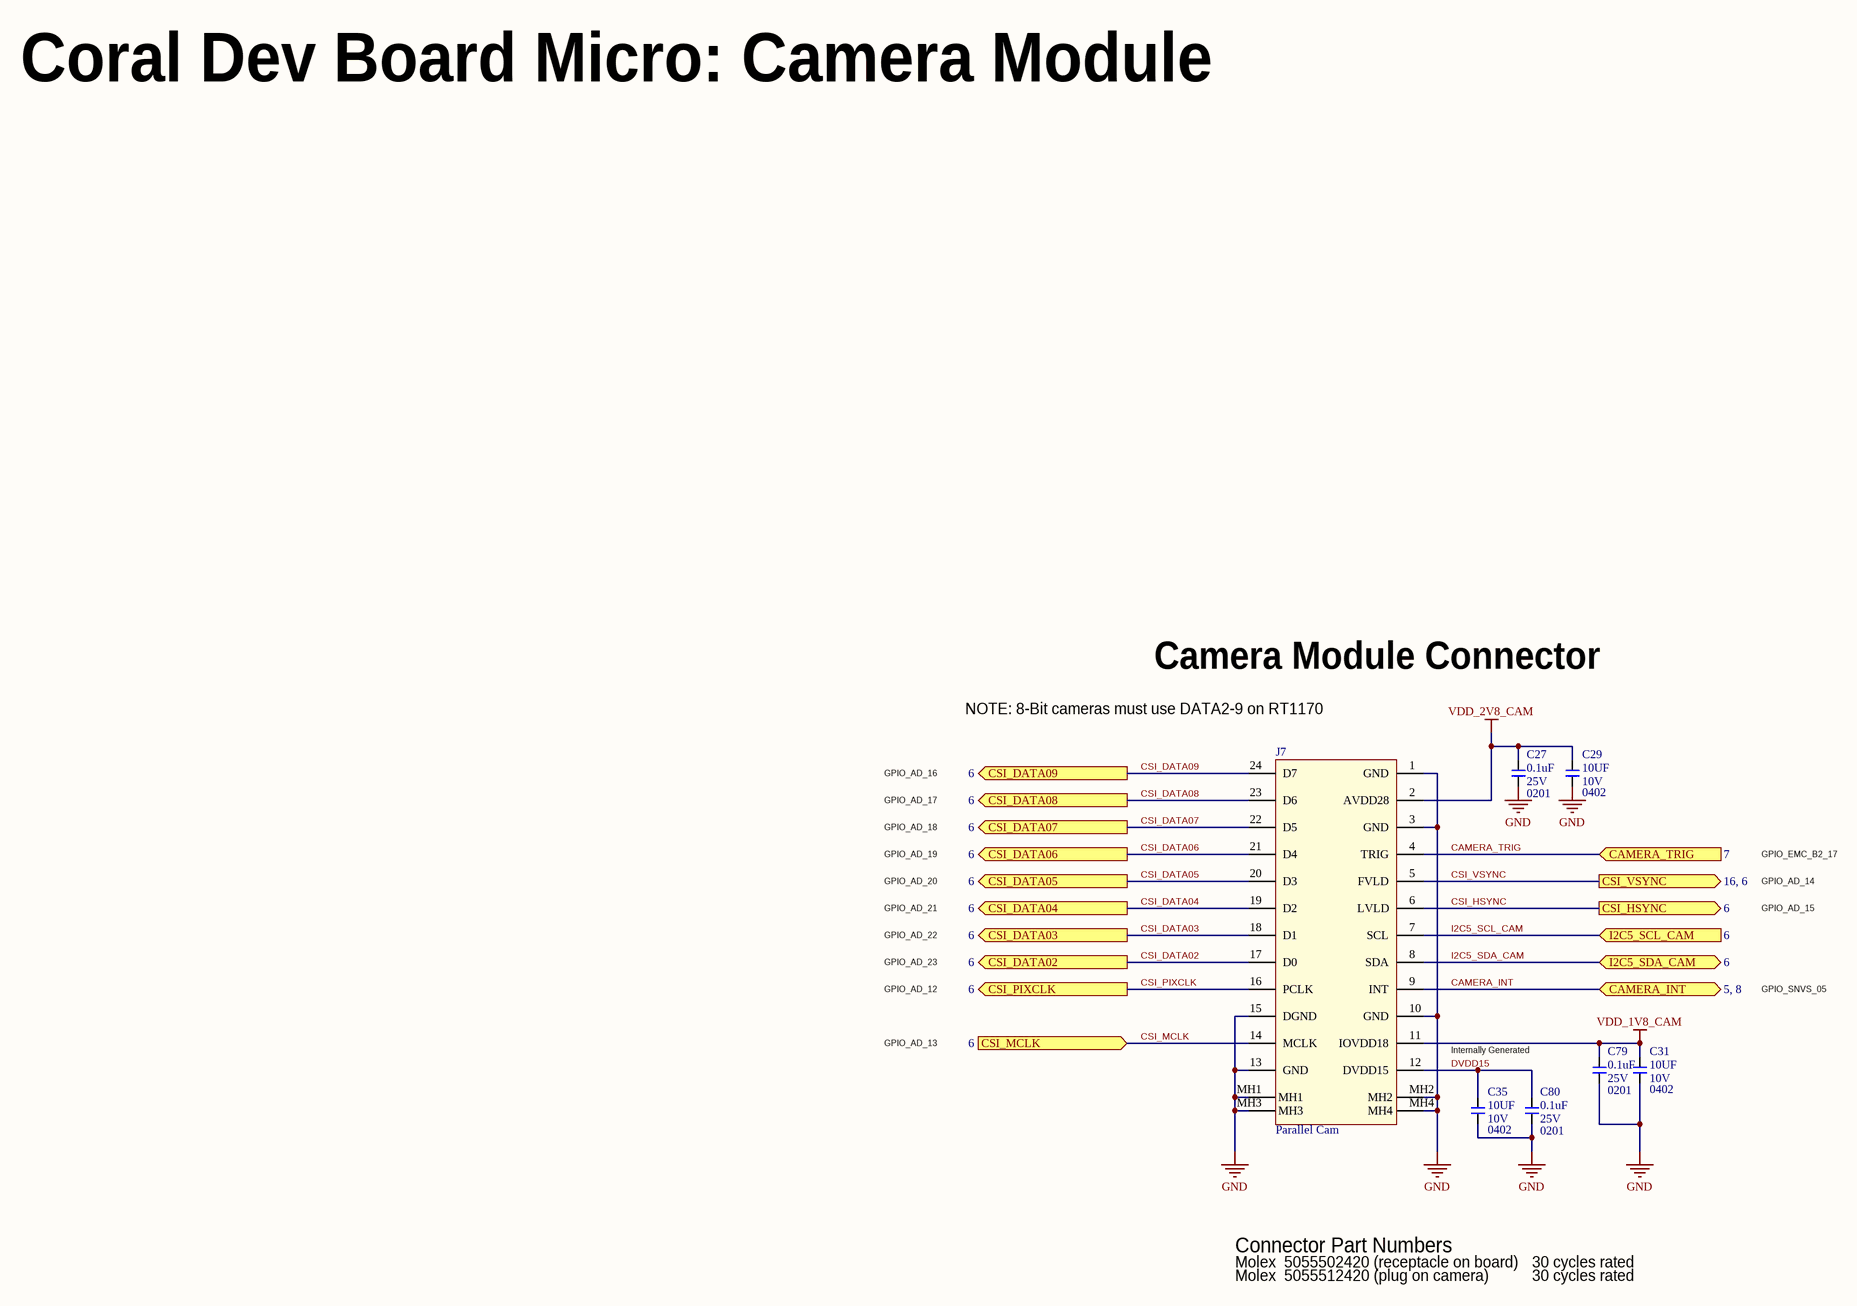
[diagram p13: 09 Parallel Camera.SchDoc]

### Parts
C27  value 0.1uF  Package: 0201  Voltage: 25V  [C0201Y]  (hidden comment: __Template_Cap)
C29  value 10UF  Package: 0402  Voltage: 10V  [C0402]  (hidden comment: __Template_Cap)
C31  value 10UF  Package: 0402  Voltage: 10V  [C0402]  (hidden comment: __Template_Cap)
C35  value 10UF  Package: 0402  Voltage: 10V  [C0402]  (hidden comment: __Template_Cap)
C79  value 0.1uF  Package: 0201  Voltage: 25V  [C0201Y]  (hidden comment: __Template_Cap)
C80  value 0.1uF  Package: 0201  Voltage: 25V  [C0201Y]  (hidden comment: __Template_Cap)
J7  MFG P/N: Parallel Cam  [Molex_5037722410_HM01B0]  (hidden comment: 1087)

### Ports
CAMERA_INT (bidir, see 5, 8), CAMERA_TRIG (in, see 7), CSI_DATA02 (out, see 6), CSI_DATA03 (out, see 6), CSI_DATA04 (out, see 6), CSI_DATA05 (out, see 6), CSI_DATA06 (out, see 6), CSI_DATA07 (out, see 6), CSI_DATA08 (out, see 6), CSI_DATA09 (out, see 6), CSI_HSYNC (out, see 6), CSI_MCLK (in, see 6), CSI_PIXCLK (out, see 6), CSI_VSYNC (out, see 16, 6), I2C5_SCL_CAM (in, see 6), I2C5_SDA_CAM (bidir, see 6)

### Nets
GND: C27.2 C29.2 C31.2 C35.2 C79.2 C80.2 J7.1(GND) J7.3(GND) J7.10(GND) J7.13(GND) J7.15(DGND) J7.MH1 J7.MH2 J7.MH3 J7.MH4
VDD_1V8_CAM: C31.1 C79.1 J7.11(IOVDD18)
VDD_2V8_CAM: C27.1 C29.1 J7.2(AVDD28)
CAMERA_INT: J7.9(INT) ; port CAMERA_INT
CAMERA_TRIG: J7.4(TRIG) ; port CAMERA_TRIG
CSI_DATA02: J7.17(D0) ; port CSI_DATA02
CSI_DATA03: J7.18(D1) ; port CSI_DATA03
CSI_DATA04: J7.19(D2) ; port CSI_DATA04
CSI_DATA05: J7.20(D3) ; port CSI_DATA05
CSI_DATA06: J7.21(D4) ; port CSI_DATA06
CSI_DATA07: J7.22(D5) ; port CSI_DATA07
CSI_DATA08: J7.23(D6) ; port CSI_DATA08
CSI_DATA09: J7.24(D7) ; port CSI_DATA09
CSI_HSYNC: J7.6(LVLD) ; port CSI_HSYNC
CSI_MCLK: J7.14(MCLK) ; port CSI_MCLK
CSI_PIXCLK: J7.16(PCLK) ; port CSI_PIXCLK
CSI_VSYNC: J7.5(FVLD) ; port CSI_VSYNC
DVDD15: C35.1 C80.1 J7.12(DVDD15)
I2C5_SCL_CAM: J7.7(SCL) ; port I2C5_SCL_CAM
I2C5_SDA_CAM: J7.8(SDA) ; port I2C5_SDA_CAM

### Notes on the sheet
- Coral Dev Board Micro: Camera Module
- NOTE: 8-Bit cameras must use DATA2-9 on RT1170
- Camera Module Connector
- GPIO_AD_16
- GPIO_AD_17
- GPIO_AD_18
- GPIO_AD_19
- GPIO_EMC_B2_17
- GPIO_AD_20
- GPIO_AD_21
- GPIO_AD_14
- GPIO_AD_15
- GPIO_AD_12
- GPIO_AD_22
- GPIO_AD_23
- GPIO_SNVS_05
- GPIO_AD_13
- Internally Generated
- Connector Part Numbers
- Molex  5055502420 (receptacle on board)
- Molex  5055512420 (plug on camera)
- 30 cycles rated
- Project:
- Engineer:
- Date:
- File:
- Revision:
- Sheet
- of

### Library data of the parts
C27 C79 C80 = 386: as C19 on sheet 08 B2B; Status: Released; Dielectric: X5R; Tolerance: 20%; Height: 0.33mm T; ComponentLink1Description: Datasheet; COMMON: 150-01204-00; LOON: 150-01204-00; Gecko: 150-01204-00
C29 C31 C35 = 215: CAP, CER, X5R, 10uF, 10V, 20%, 0402, 0.7mm T; ID: 215; MFG: SAMSUNG; MFG P/N: CL05A106MP5NUNC; XPN: 150-00376-00; PROXY: Use ID #1342; EES: 150-04565-00; Status: Released; Dielectric: X5R; Tolerance: 20%; Height: 0.7mm T; ComponentLink1Description: Datasheet; COMMON: 150-00376-00; LOON: 150-00376-00; Gecko: 150-00376-00
J7 = 1087: HM01B0, CONN, RCPT, OUTER SHROUD, 2x12 PIN, 0.4MM P, 0.65MM H, GOLD, SM; MFG: Molex; Connector Type: Receptacle; Number of Positions: 24; Row Spacing: 2.35mm; ID: 1087; Status: Released; RoHS Compliant: Yes; Mounting Type: Surface Mount; Orientation: Vertical; Pitch: 0.4mm; Number of Rows: 2; Gender: Receptacle; Features: Outer Shroud Contacts; Supplier 1: Digi-Key; HelpURL: https://www.digikey.com/product-detail/en/molex/5037722410/WM6251CT-ND/2794320; ComponentLink1Description: Datasheet; ComponentLink1URL: https://www.molex.com/pdm_docs/sd/5037722410_sd.pdf; Height: 0.76mm; Supplier Part Number 1: WM6251CT-ND; ComponentLink2Description: HMB01B0 Datasheet; ComponentLink2URL: https://drive.google.com/a/google.com/file/d/1hz92MYY5mTVHUf_ZbvAIbaEPUMPymuL2/view?usp=sharing

## Sheet 10 FLASH_BOOT.SchDoc: Coral 6 Layer Template With Controlled Impedances
size A2; ApprovedBy: DNP; CheckedBy: DNP; Author: DNP; CompanyName: Google LLC; DrawnBy: DNP; Engineer: Stefan; Organization: Google LLC; Address1: 1600 Amphitheatre Parkway; Address2: Mountain View, CA 94043; Address3: DNP; Address4: DNP; DocumentNumber: 10; Revision: PVT; SheetNumber: 10; SheetTotal: 17; VersionControl_RevNumber: DNP; IsUserConfigurable: DNP; Time: DNP; ImagePath: DNP; Rule: DNP; ProjectName: Enterprise; Application_BuildNumber: DNP
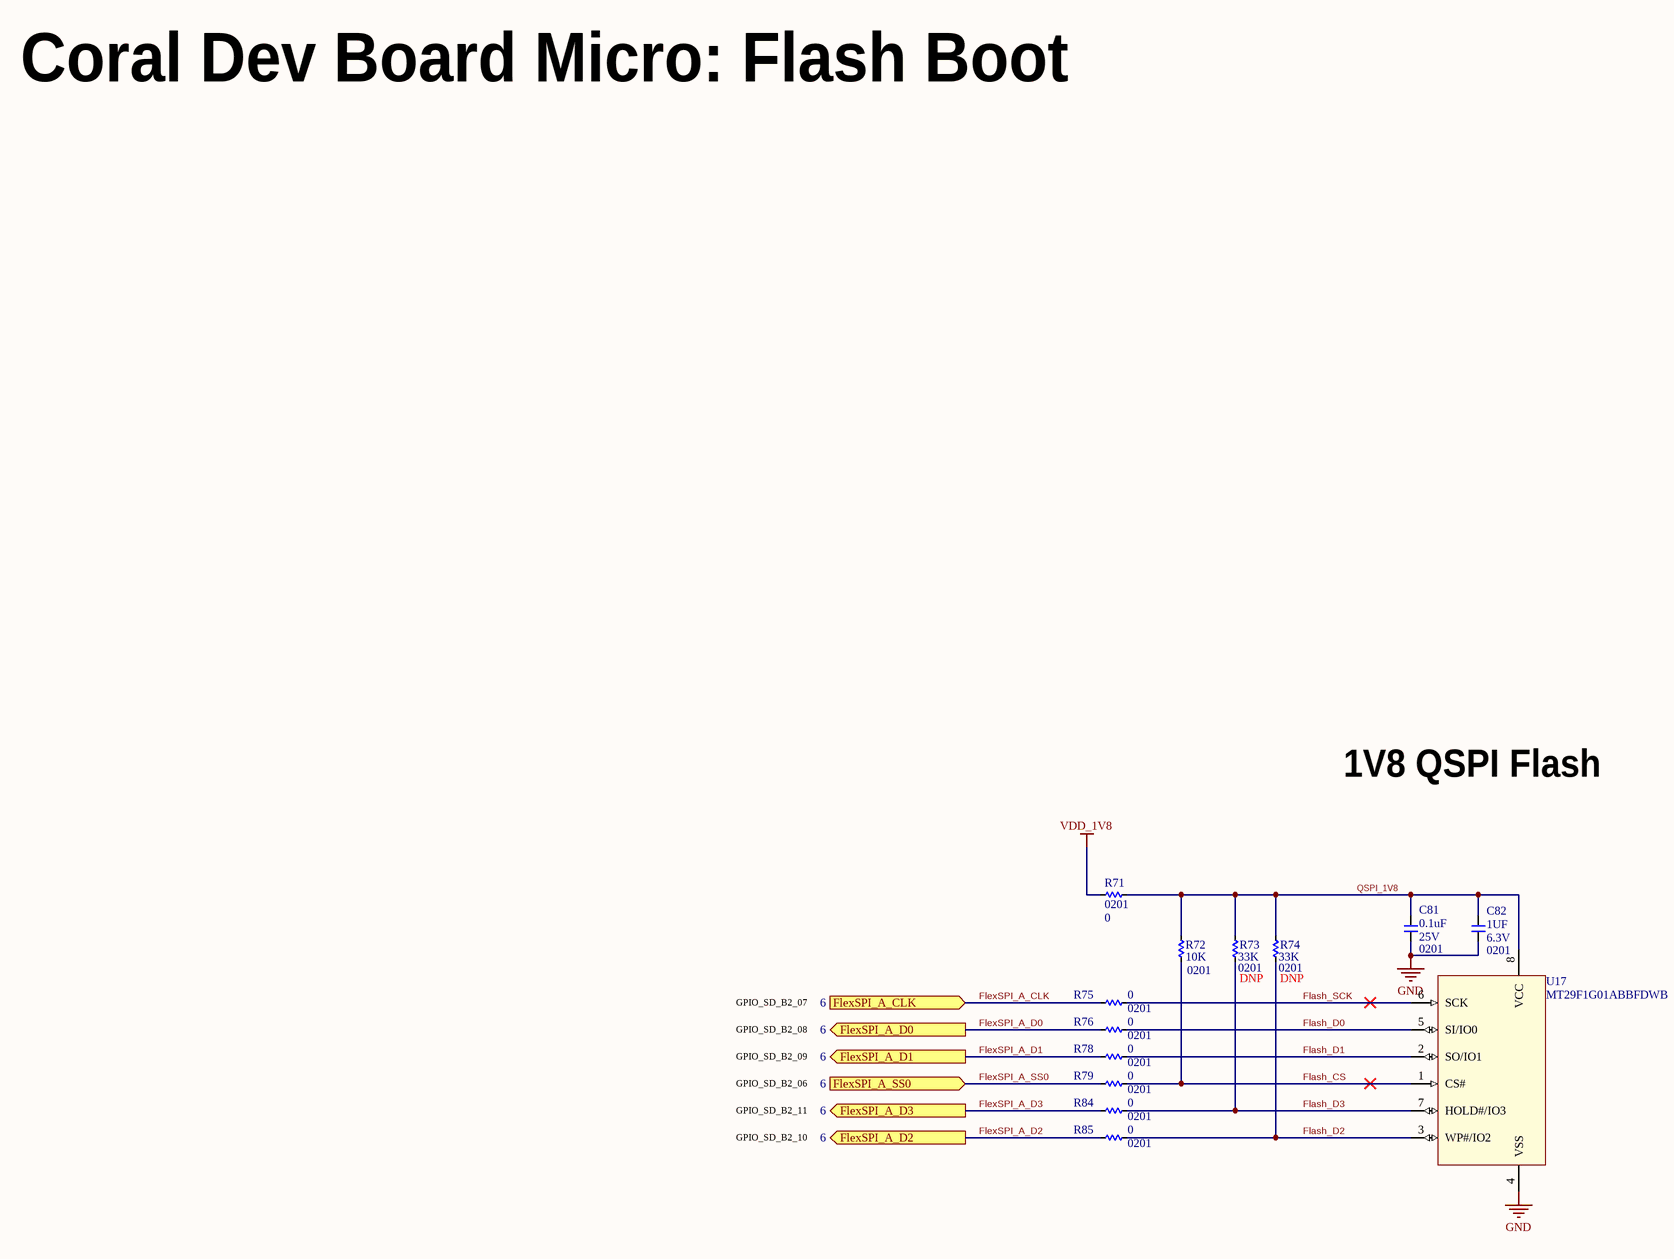
[diagram p14: 10 FLASH_BOOT.SchDoc]

### Parts
C81  value 0.1uF  Package: 0201  Voltage: 25V  [C0201Y]  (hidden comment: __Template_Cap)
C82  value 1UF  Package: 0201  Voltage: 6.3V  [C0201_H0.39MM]  (hidden comment: __Template_Cap)
R71  value 0  Package: 0201  [R0201]
R72  value 10K  Package: 0201  [R0201]
R73  value 33K  Package: 0201  [R0201]
R74  value 33K  Package: 0201  [R0201]
R75  value 0  Package: 0201  [R0201]
R76  value 0  Package: 0201  [R0201]
R78  value 0  Package: 0201  [R0201]
R79  value 0  Package: 0201  [R0201]
R84  value 0  Package: 0201  [R0201]
R85  value 0  Package: 0201  [R0201]
U17  MFG P/N: MT29F1G01ABBFDWB  [UDFN800X600X65-8]  (hidden comment: FLASH_MT29F1G01ABBFDWB)

### Ports
FlexSPI_A_CLK (in, see 6), FlexSPI_A_D0 (out, see 6), FlexSPI_A_D1 (out, see 6), FlexSPI_A_D2 (out, see 6), FlexSPI_A_D3 (out, see 6), FlexSPI_A_SS0 (in, see 6)

### Nets
GND: C81.2 C82.2 U17.4(VSS)
VDD_1V8: R71.2
Flash_CS: R72.1 R79.2 U17.1(CS#)
Flash_D0: R76.2 U17.5(SI/IO0)
Flash_D1: R78.2 U17.2(SO/IO1)
Flash_D2: R74.1 R85.2 U17.3(WP#/IO2)
Flash_D3: R73.1 R84.2 U17.7(HOLD#/IO3)
Flash_SCK: R75.2 U17.6(SCK)
FlexSPI_A_CLK: R75.1 ; port FlexSPI_A_CLK
FlexSPI_A_D0: R76.1 ; port FlexSPI_A_D0
FlexSPI_A_D1: R78.1 ; port FlexSPI_A_D1
FlexSPI_A_D2: R85.1 ; port FlexSPI_A_D2
FlexSPI_A_D3: R84.1 ; port FlexSPI_A_D3
FlexSPI_A_SS0: R79.1 ; port FlexSPI_A_SS0
QSPI_1V8: C81.1 C82.1 R71.1 R72.2 R73.2 R74.2 U17.8(VCC)

### Notes on the sheet
- Coral Dev Board Micro: Flash Boot
- 1V8 QSPI Flash
- GPIO_SD_B2_07
- GPIO_SD_B2_08
- GPIO_SD_B2_06
- GPIO_SD_B2_09
- GPIO_SD_B2_11
- GPIO_SD_B2_10
- Project:
- Engineer:
- Date:
- File:
- Revision:
- Sheet
- of

### Library data of the parts
C81 = 386: as C19 on sheet 08 B2B; Status: Released; Dielectric: X5R; Tolerance: 20%; Height: 0.33mm T; ComponentLink1Description: Datasheet; COMMON: 150-01204-00; LOON: 150-01204-00; Gecko: 150-01204-00
C82 = 1771: as C119 on sheet 07 MIMXRT1170 PART3; Status: In Development; Dielectric: X6S; Tolerance: 20%; Height: 0.39mm; Supplier 1: Digi-Key; HelpURL: https://www.digikey.com/product-detail/en/murata-electronics-north-america/GRM033C80J105ME05D/490-13218-1-ND/5877426; ComponentLink1Description: Datasheet; ComponentLink1URL: https://psearch.en.murata.com/capacitor/product/GRM033C80J105ME05%23.pdf; Supplier Part Number 1: 490-13218-1-ND
R71 R75 R76 R78 R79 R84 R85 = 8315: as R1848 on sheet 07 MIMXRT1170 PART3; Status: Released; Power: 1/20W; LOON: 470-00013-00; Gecko: 470-00013-00; XPN: 470-00013-00
R72 = 4151: RES, 10K, 1%, 1/20W, 0201; ID: 4151; MFG: YAGEO; MFG P/N: RC0201FR-0710KL; COMMON: 470-00033-00; PROXY: 470-16076-00; Status: Released; Power: 1/20W; Tolerance: 1%; Height: 0.26mm; Supplier 1: Digi-Key; LOON: 470-00033-00; Gecko: 470-00033-00; XPN: 470-00033-00; Supplier Part Number 1: 311-10.0KMCT-ND
R73 R74 = 8374: RES, 33K, 1%, 1/20W, 0201; ID: 8374; MFG: YAGEO; MFG P/N: RC0201FR-0733KL; COMMON: 470-00060-00; Status: Released; Power: 1/20W; Tolerance: 1%; LOON: 470-00060-00; Gecko: 470-00060-00; XPN: 470-00060-00; DNP: DNP
U17 = 428: IC, MEMORY, MT29F1G01ABB, NON-VOLATILE, FLASH, 1Gb(1G x 1), SPI, 1.7 TO 1.95V VIN, UDFN-8; ID: 428; MFG: Micron Technology Inc.; Status: Released; Package: 8-U-PDFN (8x6); Category: Integrated Circuits (ICs); RoHS Compliant: Yes; Supplier 1: Digi-Key; ComponentLink1Description: Datasheet; ComponentLink1URL: https://drive.google.com/file/d/1C-NTATQpKfaFS0xUlD5OwC7TQ7HH5Sp1/view; Mounting Type: SMD; Height: 0.65mm; Supplier Part Number 1: MT29F1G01ABBFDWB-IT:F-ND; HelpURL: https://www.digikey.com/en/products/detail/micron-technology-inc/mt29f1g01abbfdwb-it-f/7707445

## Sheet 11 SDRAM.SchDoc: Coral 6 Layer Template With Controlled Impedances
size A2; ApprovedBy: DNP; CheckedBy: DNP; Author: DNP; CompanyName: Google LLC; DrawnBy: DNP; Engineer: Stefan; Organization: Google LLC; Address1: 1600 Amphitheatre Parkway; Address2: Mountain View, CA 94043; Address3: DNP; Address4: DNP; DocumentNumber: 11; Revision: PVT; SheetNumber: 11; SheetTotal: 17; VersionControl_RevNumber: DNP; IsUserConfigurable: DNP; Time: DNP; ImagePath: DNP; Rule: DNP; ProjectName: Enterprise; Application_BuildNumber: DNP
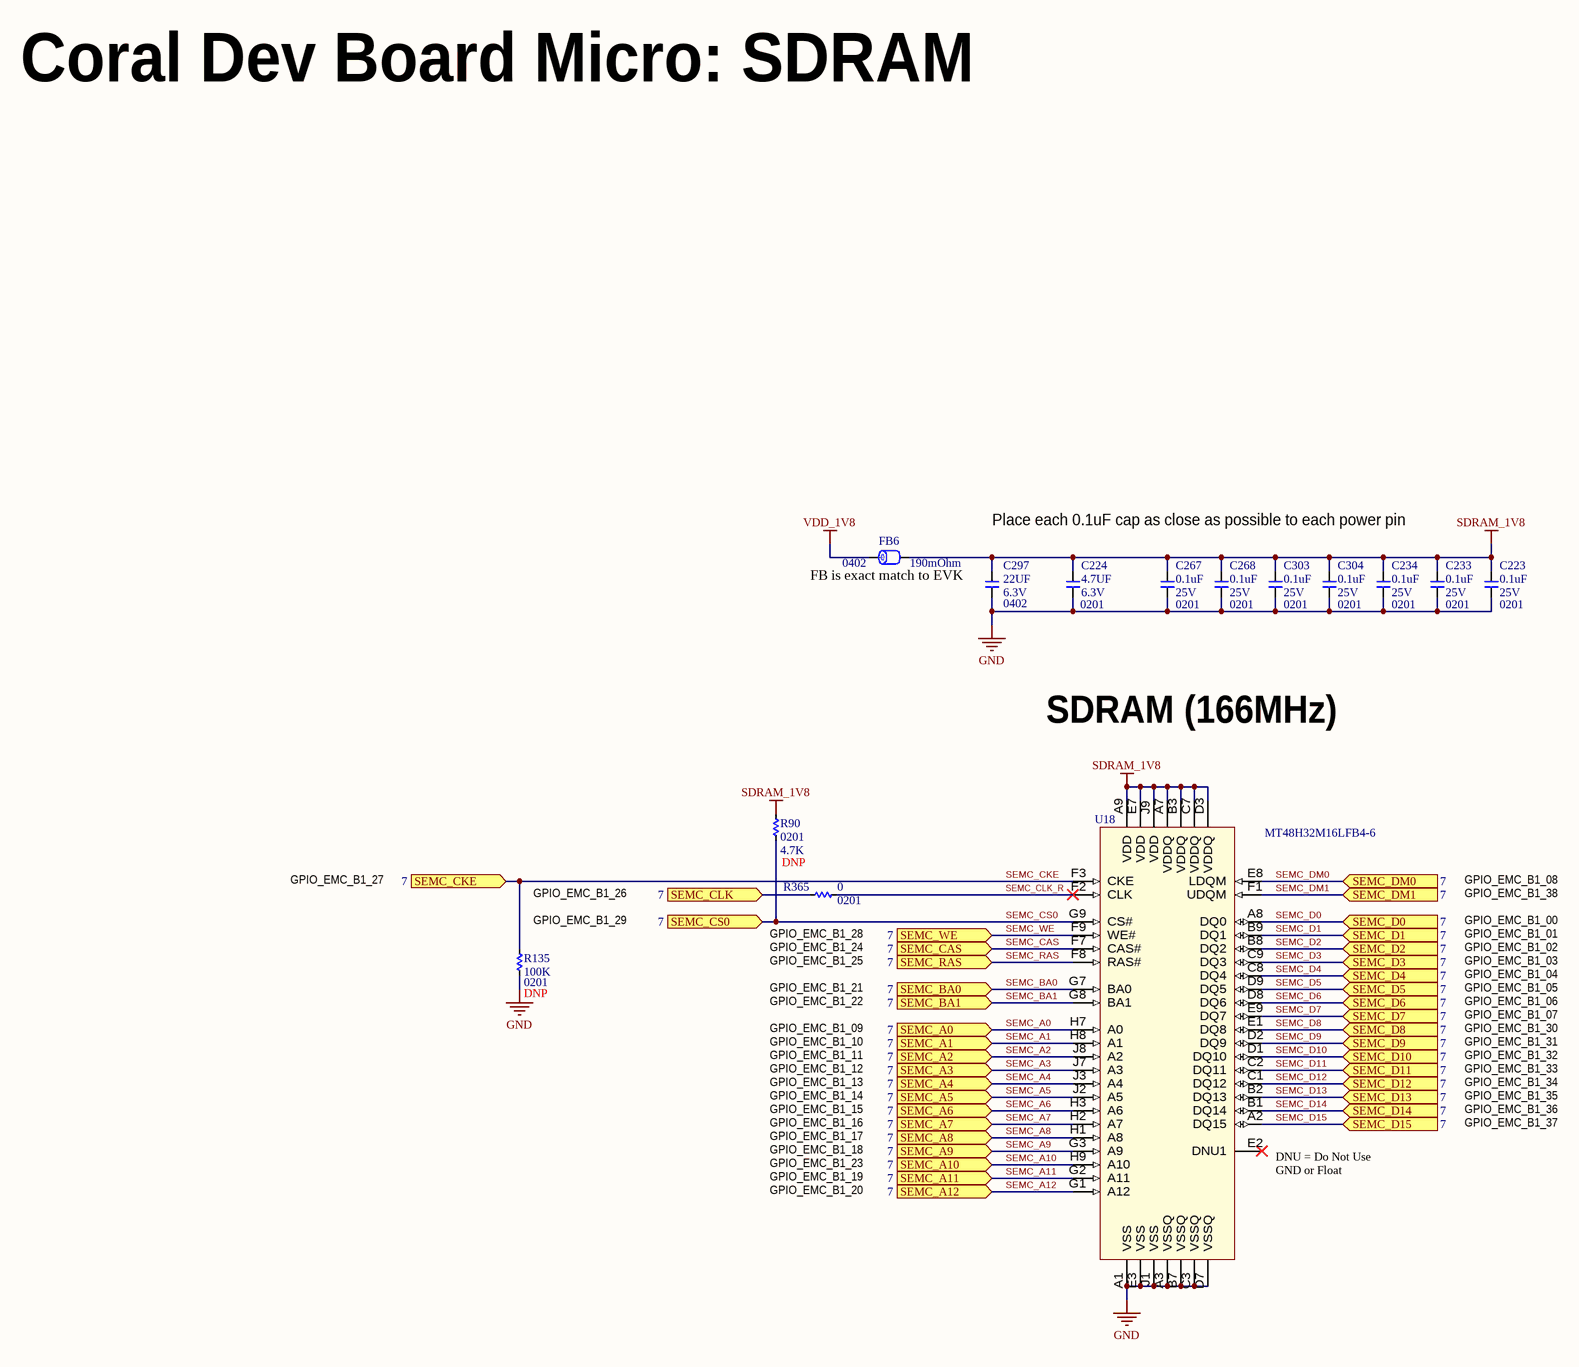
[diagram p15: 11 SDRAM.SchDoc]

### Parts
C223  value 0.1uF  Package: 0201  Voltage: 25V  [C0201Y]  (hidden comment: __Template_Cap)
C224  value 4.7UF  Package: 0201  Voltage: 6.3V  [C0201Y]  (hidden comment: __Template_Cap)
C233  value 0.1uF  Package: 0201  Voltage: 25V  [C0201Y]  (hidden comment: __Template_Cap)
C234  value 0.1uF  Package: 0201  Voltage: 25V  [C0201Y]  (hidden comment: __Template_Cap)
C267  value 0.1uF  Package: 0201  Voltage: 25V  [C0201Y]  (hidden comment: __Template_Cap)
C268  value 0.1uF  Package: 0201  Voltage: 25V  [C0201Y]  (hidden comment: __Template_Cap)
C297  value 22UF  Package: 0402  Voltage: 6.3V  [C0402]  (hidden comment: __Template_Cap)
C303  value 0.1uF  Package: 0201  Voltage: 25V  [C0201Y]  (hidden comment: __Template_Cap)
C304  value 0.1uF  Package: 0201  Voltage: 25V  [C0201Y]  (hidden comment: __Template_Cap)
FB6  Package: 0402  Rdc max: 190mOhm  [L0402_H0.55MM]  (hidden comment: __Template_Ferrite_Bead)
R90  value 4.7K  Package: 0201  [R0201]
R135  value 100K  Package: 0201  [R0201]
R365  value 0  Package: 0201  [R0201]
U18  MFG P/N: MT48H32M16LFB4-6  [BGA54C80P6X9_800X800X100]  (hidden comment: SDRAM_MT48H32M16LFB4-6)

### Ports
SEMC_A0 (in, see 7), SEMC_A1 (in, see 7), SEMC_A2 (in, see 7), SEMC_A3 (in, see 7), SEMC_A4 (in, see 7), SEMC_A5 (in, see 7), SEMC_A6 (in, see 7), SEMC_A7 (in, see 7), SEMC_A8 (in, see 7), SEMC_A9 (in, see 7), SEMC_A10 (in, see 7), SEMC_A11 (in, see 7), SEMC_A12 (in, see 7), SEMC_BA0 (in, see 7), SEMC_BA1 (in, see 7), SEMC_CAS (in, see 7), SEMC_CKE (in, see 7), SEMC_CLK (in, see 7), SEMC_CS0 (in, see 7), SEMC_D0 (in, see 7), SEMC_D1 (in, see 7), SEMC_D2 (in, see 7), SEMC_D3 (in, see 7), SEMC_D4 (in, see 7), SEMC_D5 (in, see 7), SEMC_D6 (in, see 7), SEMC_D7 (in, see 7), SEMC_D8 (in, see 7), SEMC_D9 (in, see 7), SEMC_D10 (in, see 7), SEMC_D11 (in, see 7), SEMC_D12 (in, see 7), SEMC_D13 (in, see 7), SEMC_D14 (in, see 7), SEMC_D15 (in, see 7), SEMC_DM0 (in, see 7), SEMC_DM1 (in, see 7), SEMC_RAS (in, see 7), SEMC_WE (in, see 7)

### Nets
GND: C223.2 C224.2 C233.2 C234.2 C267.2 C268.2 C297.2 C303.2 C304.2 R135.1 U18.A1(VSS) U18.A3(VSSQ) U18.B7(VSSQ) U18.C3(VSSQ) U18.D7(VSSQ) U18.E3(VSS) U18.J1(VSS)
SDRAM_1V8: C223.1 C224.1 C233.1 C234.1 C267.1 C268.1 C297.1 C303.1 C304.1 FB6.2 R90.2 U18.A7(VDDQ) U18.A9(VDD) U18.B3(VDDQ) U18.C7(VDDQ) U18.D3(VDDQ) U18.E7(VDD) U18.J9(VDD)
VDD_1V8: FB6.1
SEMC_A0: U18.H7(A0) ; port SEMC_A0
SEMC_A1: U18.H8(A1) ; port SEMC_A1
SEMC_A2: U18.J8(A2) ; port SEMC_A2
SEMC_A3: U18.J7(A3) ; port SEMC_A3
SEMC_A4: U18.J3(A4) ; port SEMC_A4
SEMC_A5: U18.J2(A5) ; port SEMC_A5
SEMC_A6: U18.H3(A6) ; port SEMC_A6
SEMC_A7: U18.H2(A7) ; port SEMC_A7
SEMC_A8: U18.H1(A8) ; port SEMC_A8
SEMC_A9: U18.G3(A9) ; port SEMC_A9
SEMC_A10: U18.H9(A10) ; port SEMC_A10
SEMC_A11: U18.G2(A11) ; port SEMC_A11
SEMC_A12: U18.G1(A12) ; port SEMC_A12
SEMC_BA0: U18.G7(BA0) ; port SEMC_BA0
SEMC_BA1: U18.G8(BA1) ; port SEMC_BA1
SEMC_CAS: U18.F7(CAS#) ; port SEMC_CAS
SEMC_CKE: R135.2 U18.F3(CKE) ; port SEMC_CKE
SEMC_CLK: R365.1 ; port SEMC_CLK
SEMC_CLK_R: R365.2 U18.F2(CLK)
SEMC_CS0: R90.1 U18.G9(CS#) ; port SEMC_CS0
SEMC_D0: U18.A8(DQ0) ; port SEMC_D0
SEMC_D1: U18.B9(DQ1) ; port SEMC_D1
SEMC_D2: U18.B8(DQ2) ; port SEMC_D2
SEMC_D3: U18.C9(DQ3) ; port SEMC_D3
SEMC_D4: U18.C8(DQ4) ; port SEMC_D4
SEMC_D5: U18.D9(DQ5) ; port SEMC_D5
SEMC_D6: U18.D8(DQ6) ; port SEMC_D6
SEMC_D7: U18.E9(DQ7) ; port SEMC_D7
SEMC_D8: U18.E1(DQ8) ; port SEMC_D8
SEMC_D9: U18.D2(DQ9) ; port SEMC_D9
SEMC_D10: U18.D1(DQ10) ; port SEMC_D10
SEMC_D11: U18.C2(DQ11) ; port SEMC_D11
SEMC_D12: U18.C1(DQ12) ; port SEMC_D12
SEMC_D13: U18.B2(DQ13) ; port SEMC_D13
SEMC_D14: U18.B1(DQ14) ; port SEMC_D14
SEMC_D15: U18.A2(DQ15) ; port SEMC_D15
SEMC_DM0: U18.E8(LDQM) ; port SEMC_DM0
SEMC_DM1: U18.F1(UDQM) ; port SEMC_DM1
SEMC_RAS: U18.F8(RAS#) ; port SEMC_RAS
SEMC_WE: U18.F9(WE#) ; port SEMC_WE

Not connected (* = marked no-connect by the designer): U18 E2(DNU1)*

### Notes on the sheet
- Coral Dev Board Micro: SDRAM
- FB is exact match to EVK
- Place each 0.1uF cap as close as possible to each power pin
- SDRAM (166MHz)
- GPIO_EMC_B1_27
- GPIO_EMC_B1_26
- GPIO_EMC_B1_38
- GPIO_EMC_B1_08
- (near R135) GPIO_EMC_B1_29
- GPIO_EMC_B1_21
- GPIO_EMC_B1_25
- (near R365) GPIO_EMC_B1_24
- (near R365) GPIO_EMC_B1_28
- GPIO_EMC_B1_00
- GPIO_EMC_B1_01
- GPIO_EMC_B1_02
- GPIO_EMC_B1_03
- GPIO_EMC_B1_04
- GPIO_EMC_B1_05
- GPIO_EMC_B1_10
- GPIO_EMC_B1_09
- GPIO_EMC_B1_22
- GPIO_EMC_B1_06
- GPIO_EMC_B1_07
- GPIO_EMC_B1_30
- GPIO_EMC_B1_31
- GPIO_EMC_B1_11
- GPIO_EMC_B1_12
- GPIO_EMC_B1_13
- GPIO_EMC_B1_14
- GPIO_EMC_B1_15
- GPIO_EMC_B1_16
- GPIO_EMC_B1_32
- GPIO_EMC_B1_33
- GPIO_EMC_B1_34
- GPIO_EMC_B1_35
- GPIO_EMC_B1_36
- GPIO_EMC_B1_37
- GPIO_EMC_B1_17
- GPIO_EMC_B1_18
- GPIO_EMC_B1_19
- GPIO_EMC_B1_23
- (near U18) DNU = Do Not Use
- (near U18) GND or Float
- GPIO_EMC_B1_20
- Project:
- Engineer:
- Date:
- File:
- Revision:
- Sheet
- of

### Library data of the parts
C223 C233 C234 C267 C268 C303 C304 = 386: as C19 on sheet 08 B2B; Status: Released; Dielectric: X5R; Tolerance: 20%; Height: 0.33mm T; ComponentLink1Description: Datasheet; COMMON: 150-01204-00; LOON: 150-01204-00; Gecko: 150-01204-00
C224 = 1199: as C235 on sheet 07 MIMXRT1170 PART3; Status: Released; Dielectric: X5R; Tolerance: 20%; Height: 0.33mm T; ComponentLink1Description: Datasheet; COMMON: 150-01224-00; LOON: 150-01224-00; Gecko: 150-01224-00
C297 = 1719: CAP, CER, X5R, 22uF, 20%, 6.3V, 0402; ID: 1719; MFG: AVX; MFG P/N: 04026D226MAT2A; XPN: 150-00420-00; PROXY: 150-03491-00; Status: Released; Dielectric: X5R; Tolerance: 20%; Height: 0.70mm; Supplier 1: Digi-Key; HelpURL: https://www.digikey.in/product-detail/en/avx-corporation/04026D226MAT2A/478-9839-1-ND/5964924; ComponentLink1Description: Datasheet; ComponentLink1URL: http://datasheets.avx.com/cx5r.pdf; COMMON: 150-00420-00; LOON: 150-00420-00; Gecko: 150-00420-00; Supplier Part Number 1: 478-9839-1-ND
FB6 = 913: as FB3-FB5 on sheet 07 MIMXRT1170 PART3; ComponentLink1Description: Datasheet; Status: Released; Idc max: 550mA; Supplier 1: Digi-Key; HelpURL: https://www.digikey.com/product-detail/en/murata-electronics/BLM15AG121SN1D/490-1005-1-ND/584453; ComponentLink1URL: https://www.murata.com/en-us/products/productdata/8796740059166/ENFA0018.pdf; Height: 0.55mm; Supplier Part Number 1: 490-1005-1-ND
R90 = 6602: RES, 4.7K, 5%, 1/20W, 0201; ID: 6602; MFG: YAGEO; MFG P/N: RC0201JR-074K7L; COMMON: 470-00012-00; Status: Released; Power: 1/20W; Tolerance: 5%; LOON: 470-00012-00; Gecko: 470-00012-00; XPN: 470-00012-00; DNP: DNP
R135 = 6760: RES, 100K, 1%, 1/20W, 0201; ID: 6760; MFG: PANASONIC; MFG P/N: ERJ1GNF1003C; COMMON: 470-00506-00; Status: Released; Power: 1/20W; Tolerance: 1%; LOON: 470-00506-00; Gecko: 470-00506-00; XPN: 470-00506-00; DNP: DNP
R365 = 8315: as R1848 on sheet 07 MIMXRT1170 PART3; Status: Released; Power: 1/20W; LOON: 470-00013-00; Gecko: 470-00013-00; XPN: 470-00013-00
U18 = 427: IC, MEMORY, MT48H32M16, VOLATILE, DRAM, 512Mb(32M x 16), 1.7 TO 1.95V VIN, VFBGA-54; ID: 427; MFG: Micron Technology Inc.; Status: Released; Package: 54-VFBGA (8x8); Category: Integrated Circuits (ICs); RoHS Compliant: Yes; Supplier 1: Digi-Key; ComponentLink1Description: Datasheet; ComponentLink1URL: https://drive.google.com/file/d/1ZqN_IvmDCh6UxoJlg56_oHNDqlNjxBG5/view; Mounting Type: SMD; Height: 1mm; Supplier Part Number 1: MT48H32M16LFB4-6IT:C-ND; HelpURL: https://www.digikey.com/en/products/detail/micron-technology-inc/mt48h32m16lfb4-6-it-c/4315912

## Sheet 12 DMIC.SchDoc: Coral 6 Layer Template With Controlled Impedances
size A2; ApprovedBy: DNP; CheckedBy: DNP; Author: DNP; CompanyName: Google LLC; DrawnBy: DNP; Engineer: Stefan; Organization: Google LLC; Address1: 1600 Amphitheatre Parkway; Address2: Mountain View, CA 94043; Address3: DNP; Address4: DNP; DocumentNumber: 12; Revision: PVT; SheetNumber: 12; SheetTotal: 17; VersionControl_RevNumber: DNP; IsUserConfigurable: DNP; Time: DNP; ImagePath: DNP; Rule: DNP; ProjectName: Enterprise; Application_BuildNumber: DNP
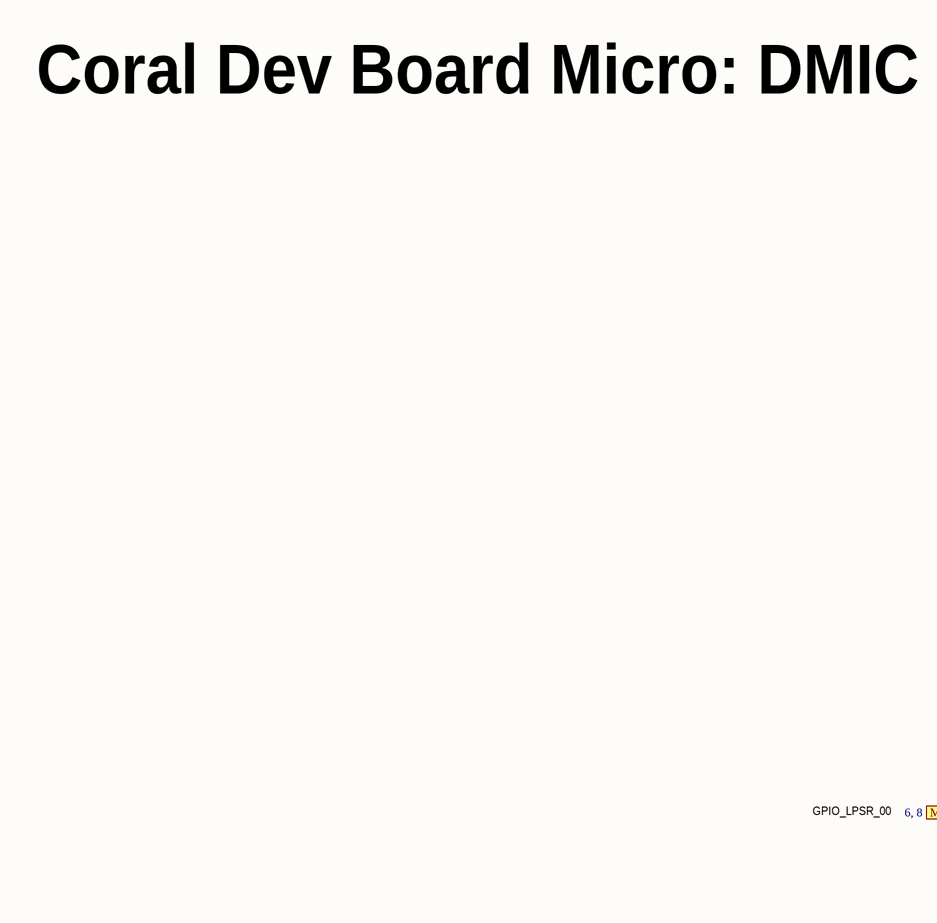
[diagram p16: 12 DMIC.SchDoc, left]
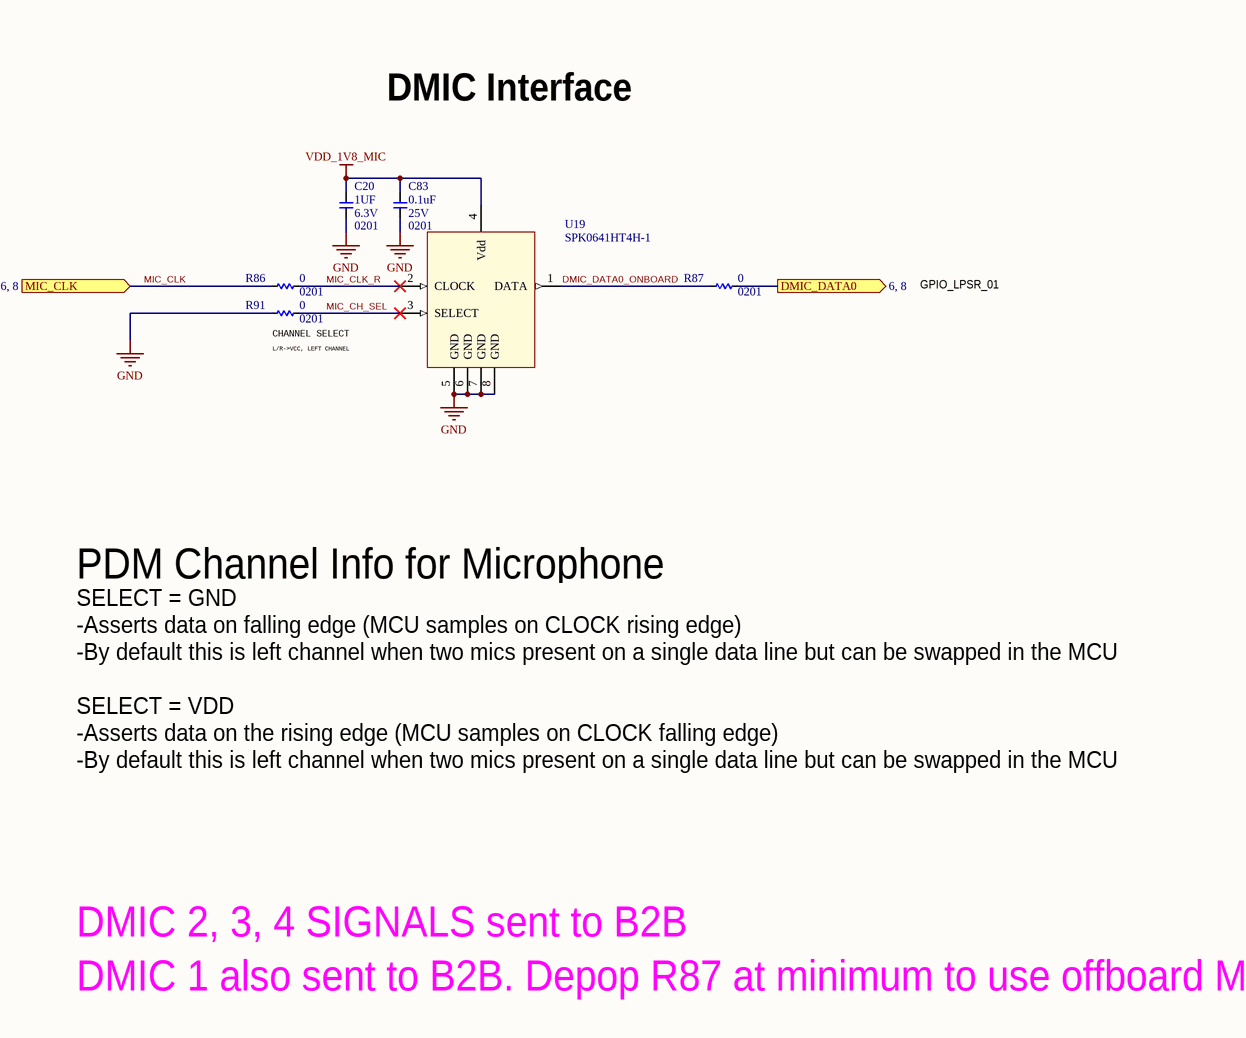
[diagram p17: 12 DMIC.SchDoc, right]

### Parts
C20  value 1UF  Package: 0201  Voltage: 6.3V  [C0201_H0.39MM]  (hidden comment: __Template_Cap)
C83  value 0.1uF  Package: 0201  Voltage: 25V  [C0201Y]  (hidden comment: __Template_Cap)
R86  value 0  Package: 0201  [R0201]
R87  value 0  Package: 0201  [R0201]
R91  value 0  Package: 0201  [R0201]
U19  MFG P/N: SPK0641HT4H-1  [MIC_SPK0641HT4H-1]  (hidden comment: MIC_SPK0641HT4H-1)

### Ports
DMIC_DATA0 (out, see 6, 8), MIC_CLK (in, see 6, 8)

### Nets
GND: C20.2 C83.2 R91.1 U19.5(GND) U19.6(GND) U19.7(GND) U19.8(GND)
VDD_1V8_MIC: C20.1 C83.1 U19.4(Vdd)
DMIC_DATA0: R87.2 ; port DMIC_DATA0
DMIC_DATA0_ONBOARD: R87.1 U19.1(DATA)
MIC_CH_SEL: R91.2 U19.3(SELECT)
MIC_CLK: R86.1 ; port MIC_CLK
MIC_CLK_R: R86.2 U19.2(CLOCK)

### Notes on the sheet
- Coral Dev Board Micro: DMIC
- DMIC Interface
- GPIO_LPSR_00
- (near R91) CHANNEL SELECT
- GPIO_LPSR_01
- (near R91) L/R->VCC, LEFT CHANNEL
- PDM Channel Info for Microphone
- SELECT = GND
  -Asserts data on falling edge (MCU samples on CLOCK rising edge)
  -By default this is left channel when two mics present on a single data line but can be swapped in the MCU
  SELECT = VDD
  -Asserts data on the rising edge (MCU samples on CLOCK falling edge)
  -By default this is left channel when two mics present on a single data line but can be swapped in the MCU
- DMIC 2, 3, 4 SIGNALS sent to B2B
- DMIC 1 also sent to B2B. Depop R87 at minimum to use offboard MIC1 left channel.
- Project:
- Engineer:
- Date:
- File:
- Revision:
- Sheet
- of

### Library data of the parts
C20 = 1771: as C119 on sheet 07 MIMXRT1170 PART3; Status: In Development; Dielectric: X6S; Tolerance: 20%; Height: 0.39mm; Supplier 1: Digi-Key; HelpURL: https://www.digikey.com/product-detail/en/murata-electronics-north-america/GRM033C80J105ME05D/490-13218-1-ND/5877426; ComponentLink1Description: Datasheet; ComponentLink1URL: https://psearch.en.murata.com/capacitor/product/GRM033C80J105ME05%23.pdf; Supplier Part Number 1: 490-13218-1-ND
C83 = 386: as C19 on sheet 08 B2B; Status: Released; Dielectric: X5R; Tolerance: 20%; Height: 0.33mm T; ComponentLink1Description: Datasheet; COMMON: 150-01204-00; LOON: 150-01204-00; Gecko: 150-01204-00
R86 R87 R91 = 8315: as R1848 on sheet 07 MIMXRT1170 PART3; Status: Released; Power: 1/20W; LOON: 470-00013-00; Gecko: 470-00013-00; XPN: 470-00013-00
U19 = 212: AUDIO, MIC, MEMS, OMNIDIRECTIONAL, DIGITAl/PDM O/P, 20Hz TO 20KHz, -26dB SENSITIVITY, +/-1dB, 64.5dB S/N R, SMD; ID: 212; MFG: Knowles; Voltage, Rated: 1.6 V ~ 3.6 V; Status: Released; Category: Microphones; RoHS Compliant: Yes; Supplier 1: Digi-Key; Height: 1.1mm; Mounting Type: SMD; HelpURL: https://www.digikey.com/en/products/detail/knowles/SPK0641HT4H-1/8573345; ComponentLink1Description: Datasheet; ComponentLink1URL: https://www.knowles.com/docs/default-source/model-downloads/spk0641ht4h-1-rev-a.pdf; Supplier Part Number 1: 423-1425-2-ND